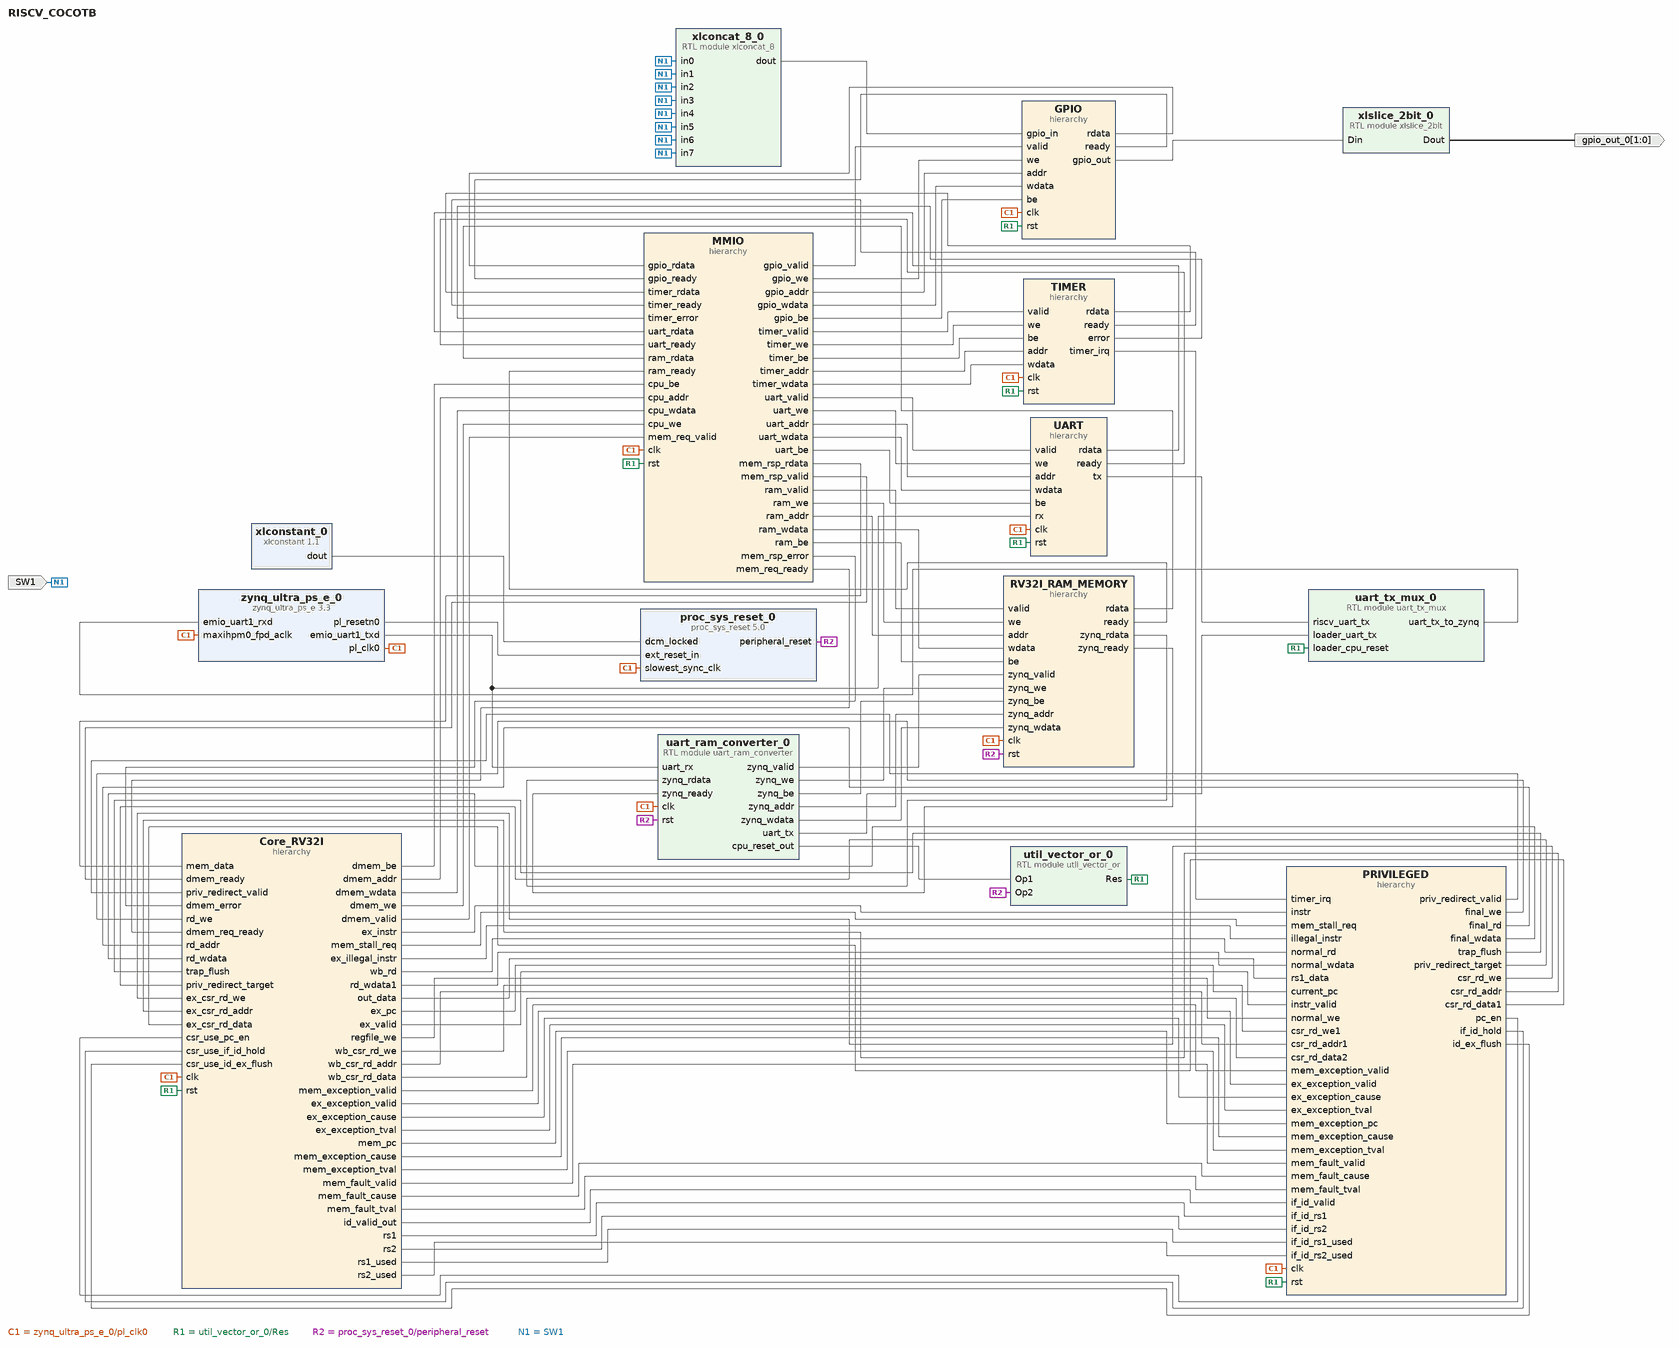
[diagram p0: block diagram of the top level]
# Vivado block design RISCV_COCOTB, xczu5ev-sfvc784-2-i, Vivado 2020.1
create_bd_design RISCV_COCOTB

create_bd_port -dir O -from 1 -to 0 gpio_out_0
create_bd_port -dir I SW1

create_bd_cell -type hier UART
create_bd_cell -type hier TIMER
create_bd_cell -type hier Core_RV32I
create_bd_cell -type hier MMIO
create_bd_cell -type hier PRIVILEGED
create_bd_cell -type hier GPIO
create_bd_cell -type hier RV32I_RAM_MEMORY
create_bd_cell -type module -reference xlconcat_8 xlconcat_8_0
create_bd_cell -type module -reference xlslice_2bit xlslice_2bit_0
create_bd_cell -type ip -vlnv xilinx.com:ip:zynq_ultra_ps_e:3.3 zynq_ultra_ps_e_0
set_property -dict [list \
  CONFIG.CAN0_BOARD_INTERFACE custom \
  CONFIG.CAN1_BOARD_INTERFACE custom \
  CONFIG.CSU_BOARD_INTERFACE custom \
  CONFIG.DP_BOARD_INTERFACE custom \
  CONFIG.GEM0_BOARD_INTERFACE custom \
  CONFIG.GEM1_BOARD_INTERFACE custom \
  CONFIG.GEM2_BOARD_INTERFACE custom \
  CONFIG.GEM3_BOARD_INTERFACE custom \
  CONFIG.GPIO_BOARD_INTERFACE custom \
  CONFIG.IIC0_BOARD_INTERFACE custom \
  CONFIG.IIC1_BOARD_INTERFACE custom \
  CONFIG.NAND_BOARD_INTERFACE custom \
  CONFIG.PCIE_BOARD_INTERFACE custom \
  CONFIG.PJTAG_BOARD_INTERFACE custom \
  CONFIG.PMU_BOARD_INTERFACE custom \
  CONFIG.PSU_BANK_0_IO_STANDARD LVCMOS18 \
  CONFIG.PSU_BANK_1_IO_STANDARD LVCMOS18 \
  CONFIG.PSU_BANK_2_IO_STANDARD LVCMOS18 \
  CONFIG.PSU_BANK_3_IO_STANDARD LVCMOS18 \
  CONFIG.PSU_USB3__DUAL_CLOCK_ENABLE 1 \
  CONFIG.PSU__CAN0__PERIPHERAL__ENABLE 1 \
  CONFIG.PSU__CAN0__PERIPHERAL__IO EMIO \
  CONFIG.PSU__CAN1__PERIPHERAL__ENABLE 0 \
  CONFIG.PSU__CRF_APB__ACPU_CTRL__FREQMHZ 1200 \
  CONFIG.PSU__CRF_APB__ACPU_CTRL__SRCSEL APLL \
  CONFIG.PSU__CRF_APB__APLL_CTRL__SRCSEL PSS_REF_CLK \
  CONFIG.PSU__CRF_APB__DBG_FPD_CTRL__FREQMHZ 250 \
  CONFIG.PSU__CRF_APB__DBG_FPD_CTRL__SRCSEL IOPLL \
  CONFIG.PSU__CRF_APB__DBG_TRACE_CTRL__FREQMHZ 250 \
  CONFIG.PSU__CRF_APB__DBG_TRACE_CTRL__SRCSEL IOPLL \
  CONFIG.PSU__CRF_APB__DBG_TSTMP_CTRL__FREQMHZ 250 \
  CONFIG.PSU__CRF_APB__DBG_TSTMP_CTRL__SRCSEL IOPLL \
  CONFIG.PSU__CRF_APB__DDR_CTRL__FREQMHZ 1200 \
  CONFIG.PSU__CRF_APB__DDR_CTRL__SRCSEL DPLL \
  CONFIG.PSU__CRF_APB__DPDMA_REF_CTRL__FREQMHZ 600 \
  CONFIG.PSU__CRF_APB__DPDMA_REF_CTRL__SRCSEL DPLL \
  CONFIG.PSU__CRF_APB__DPLL_CTRL__SRCSEL PSS_REF_CLK \
  CONFIG.PSU__CRF_APB__DP_AUDIO_REF_CTRL__SRCSEL RPLL \
  CONFIG.PSU__CRF_APB__DP_STC_REF_CTRL__SRCSEL RPLL \
  CONFIG.PSU__CRF_APB__DP_VIDEO_REF_CTRL__SRCSEL VPLL \
  CONFIG.PSU__CRF_APB__GDMA_REF_CTRL__FREQMHZ 600 \
  CONFIG.PSU__CRF_APB__GDMA_REF_CTRL__SRCSEL DPLL \
  CONFIG.PSU__CRF_APB__GPU_REF_CTRL__FREQMHZ 600 \
  CONFIG.PSU__CRF_APB__GPU_REF_CTRL__SRCSEL DPLL \
  CONFIG.PSU__CRF_APB__TOPSW_LSBUS_CTRL__FREQMHZ 100 \
  CONFIG.PSU__CRF_APB__TOPSW_LSBUS_CTRL__SRCSEL IOPLL \
  CONFIG.PSU__CRF_APB__TOPSW_MAIN_CTRL__FREQMHZ 533.333 \
  CONFIG.PSU__CRF_APB__TOPSW_MAIN_CTRL__SRCSEL DPLL \
  CONFIG.PSU__CRF_APB__VPLL_CTRL__SRCSEL PSS_REF_CLK \
  CONFIG.PSU__CRL_APB__ADMA_REF_CTRL__FREQMHZ 500 \
  CONFIG.PSU__CRL_APB__ADMA_REF_CTRL__SRCSEL IOPLL \
  CONFIG.PSU__CRL_APB__CAN1_REF_CTRL__FREQMHZ 100 \
  CONFIG.PSU__CRL_APB__CAN1_REF_CTRL__SRCSEL IOPLL \
  CONFIG.PSU__CRL_APB__CPU_R5_CTRL__FREQMHZ 500 \
  CONFIG.PSU__CRL_APB__CPU_R5_CTRL__SRCSEL IOPLL \
  CONFIG.PSU__CRL_APB__DBG_LPD_CTRL__FREQMHZ 250 \
  CONFIG.PSU__CRL_APB__DBG_LPD_CTRL__SRCSEL IOPLL \
  CONFIG.PSU__CRL_APB__GEM3_REF_CTRL__FREQMHZ 125 \
  CONFIG.PSU__CRL_APB__GEM3_REF_CTRL__SRCSEL IOPLL \
  CONFIG.PSU__CRL_APB__I2C0_REF_CTRL__FREQMHZ 100 \
  CONFIG.PSU__CRL_APB__I2C0_REF_CTRL__SRCSEL IOPLL \
  CONFIG.PSU__CRL_APB__I2C1_REF_CTRL__FREQMHZ 100 \
  CONFIG.PSU__CRL_APB__I2C1_REF_CTRL__SRCSEL IOPLL \
  CONFIG.PSU__CRL_APB__IOPLL_CTRL__SRCSEL PSS_REF_CLK \
  CONFIG.PSU__CRL_APB__IOU_SWITCH_CTRL__FREQMHZ 267 \
  CONFIG.PSU__CRL_APB__IOU_SWITCH_CTRL__SRCSEL RPLL \
  CONFIG.PSU__CRL_APB__LPD_LSBUS_CTRL__FREQMHZ 100 \
  CONFIG.PSU__CRL_APB__LPD_LSBUS_CTRL__SRCSEL IOPLL \
  CONFIG.PSU__CRL_APB__LPD_SWITCH_CTRL__FREQMHZ 500 \
  CONFIG.PSU__CRL_APB__LPD_SWITCH_CTRL__SRCSEL IOPLL \
  CONFIG.PSU__CRL_APB__PCAP_CTRL__FREQMHZ 200 \
  CONFIG.PSU__CRL_APB__PCAP_CTRL__SRCSEL IOPLL \
  CONFIG.PSU__CRL_APB__PL0_REF_CTRL__FREQMHZ 195 \
  CONFIG.PSU__CRL_APB__PL0_REF_CTRL__SRCSEL RPLL \
  CONFIG.PSU__CRL_APB__PL1_REF_CTRL__FREQMHZ 195 \
  CONFIG.PSU__CRL_APB__QSPI_REF_CTRL__FREQMHZ 300 \
  CONFIG.PSU__CRL_APB__QSPI_REF_CTRL__SRCSEL IOPLL \
  CONFIG.PSU__CRL_APB__RPLL_CTRL__SRCSEL PSS_REF_CLK \
  CONFIG.PSU__CRL_APB__SDIO1_REF_CTRL__FREQMHZ 200 \
  CONFIG.PSU__CRL_APB__SDIO1_REF_CTRL__SRCSEL RPLL \
  CONFIG.PSU__CRL_APB__TIMESTAMP_REF_CTRL__FREQMHZ 100 \
  CONFIG.PSU__CRL_APB__TIMESTAMP_REF_CTRL__SRCSEL PSS_REF_CLK \
  CONFIG.PSU__CRL_APB__UART0_REF_CTRL__FREQMHZ 100 \
  CONFIG.PSU__CRL_APB__UART0_REF_CTRL__SRCSEL IOPLL \
  CONFIG.PSU__CRL_APB__UART1_REF_CTRL__FREQMHZ 100 \
  CONFIG.PSU__CRL_APB__UART1_REF_CTRL__SRCSEL IOPLL \
  CONFIG.PSU__CRL_APB__USB0_BUS_REF_CTRL__FREQMHZ 250 \
  CONFIG.PSU__CRL_APB__USB0_BUS_REF_CTRL__SRCSEL IOPLL \
  CONFIG.PSU__CRL_APB__USB3_DUAL_REF_CTRL__FREQMHZ 20 \
  CONFIG.PSU__CRL_APB__USB3_DUAL_REF_CTRL__SRCSEL IOPLL \
  CONFIG.PSU__CRL_APB__USB3__ENABLE 1 \
  CONFIG.PSU__CSUPMU__PERIPHERAL__VALID 0 \
  CONFIG.PSU__DDRC__BUS_WIDTH {64 Bit} \
  CONFIG.PSU__DDRC__COMPONENTS Components \
  CONFIG.PSU__DDRC__DEVICE_CAPACITY {8192 MBits} \
  CONFIG.PSU__DDRC__DRAM_WIDTH {16 Bits} \
  CONFIG.PSU__DDRC__ECC Disabled \
  CONFIG.PSU__DDRC__MEMORY_TYPE {DDR 4} \
  CONFIG.PSU__DDRC__SPEED_BIN DDR4_2400R \
  CONFIG.PSU__DDR_HIGH_ADDRESS_GUI_ENABLE 1 \
  CONFIG.PSU__DDR__INTERFACE__FREQMHZ 600.000 \
  CONFIG.PSU__DEVICE_TYPE EV \
  CONFIG.PSU__DISPLAYPORT__LANE0__ENABLE 1 \
  CONFIG.PSU__DISPLAYPORT__LANE0__IO {GT Lane3} \
  CONFIG.PSU__DISPLAYPORT__LANE1__ENABLE 0 \
  CONFIG.PSU__DISPLAYPORT__PERIPHERAL__ENABLE 1 \
  CONFIG.PSU__DLL__ISUSED 1 \
  CONFIG.PSU__DPAUX__PERIPHERAL__ENABLE 1 \
  CONFIG.PSU__DPAUX__PERIPHERAL__IO {MIO 27 .. 30} \
  CONFIG.PSU__DP__LANE_SEL {Single Higher} \
  CONFIG.PSU__DP__REF_CLK_FREQ 108 \
  CONFIG.PSU__DP__REF_CLK_SEL {Ref Clk3} \
  CONFIG.PSU__ENET3__FIFO__ENABLE 0 \
  CONFIG.PSU__ENET3__GRP_MDIO__ENABLE 1 \
  CONFIG.PSU__ENET3__GRP_MDIO__IO {MIO 76 .. 77} \
  CONFIG.PSU__ENET3__PERIPHERAL__ENABLE 1 \
  CONFIG.PSU__ENET3__PERIPHERAL__IO {MIO 64 .. 75} \
  CONFIG.PSU__ENET3__PTP__ENABLE 0 \
  CONFIG.PSU__ENET3__TSU__ENABLE 0 \
  CONFIG.PSU__FPGA_PL0_ENABLE 1 \
  CONFIG.PSU__FPGA_PL1_ENABLE 1 \
  CONFIG.PSU__GEM3_COHERENCY 0 \
  CONFIG.PSU__GEM3_ROUTE_THROUGH_FPD 0 \
  CONFIG.PSU__GEM__TSU__ENABLE 0 \
  CONFIG.PSU__GPIO0_MIO__IO {MIO 0 .. 25} \
  CONFIG.PSU__GPIO0_MIO__PERIPHERAL__ENABLE 1 \
  CONFIG.PSU__GPIO1_MIO__IO {MIO 26 .. 51} \
  CONFIG.PSU__GPIO1_MIO__PERIPHERAL__ENABLE 1 \
  CONFIG.PSU__GPIO_EMIO_WIDTH 95 \
  CONFIG.PSU__GPIO_EMIO__PERIPHERAL__ENABLE 1 \
  CONFIG.PSU__GPIO_EMIO__PERIPHERAL__IO 95 \
  CONFIG.PSU__GT__LINK_SPEED HBR \
  CONFIG.PSU__GT__PRE_EMPH_LVL_4 0 \
  CONFIG.PSU__GT__VLT_SWNG_LVL_4 0 \
  CONFIG.PSU__I2C0__PERIPHERAL__ENABLE 1 \
  CONFIG.PSU__I2C0__PERIPHERAL__IO EMIO \
  CONFIG.PSU__I2C1__PERIPHERAL__ENABLE 1 \
  CONFIG.PSU__I2C1__PERIPHERAL__IO {MIO 24 .. 25} \
  CONFIG.PSU__IOU_SLCR__IOU_TTC_APB_CLK__TTC0_SEL APB \
  CONFIG.PSU__IOU_SLCR__IOU_TTC_APB_CLK__TTC1_SEL APB \
  CONFIG.PSU__IOU_SLCR__IOU_TTC_APB_CLK__TTC2_SEL APB \
  CONFIG.PSU__IOU_SLCR__IOU_TTC_APB_CLK__TTC3_SEL APB \
  CONFIG.PSU__LPD_SLCR__CSUPMU__FREQMHZ 100 \
  CONFIG.PSU__MAXIGP0__DATA_WIDTH 32 \
  CONFIG.PSU__OVERRIDE_HPX_QOS 0 \
  CONFIG.PSU__OVERRIDE__BASIC_CLOCK 0 \
  CONFIG.PSU__PMU__PERIPHERAL__ENABLE 0 \
  CONFIG.PSU__PRESET_APPLIED 0 \
  CONFIG.PSU__PSS_REF_CLK__FREQMHZ 33.333 \
  CONFIG.PSU__QSPI_COHERENCY 0 \
  CONFIG.PSU__QSPI_ROUTE_THROUGH_FPD 0 \
  CONFIG.PSU__QSPI__GRP_FBCLK__ENABLE 0 \
  CONFIG.PSU__QSPI__PERIPHERAL__DATA_MODE x4 \
  CONFIG.PSU__QSPI__PERIPHERAL__ENABLE 1 \
  CONFIG.PSU__QSPI__PERIPHERAL__IO {MIO 0 .. 12} \
  CONFIG.PSU__QSPI__PERIPHERAL__MODE {Dual Parallel} \
  CONFIG.PSU__SATA__LANE1__IO {GT Lane1} \
  CONFIG.PSU__SATA__PERIPHERAL__ENABLE 1 \
  CONFIG.PSU__SATA__REF_CLK_FREQ 125 \
  CONFIG.PSU__SATA__REF_CLK_SEL {Ref Clk1} \
  CONFIG.PSU__SD0__DATA_TRANSFER_MODE 8Bit \
  CONFIG.PSU__SD0__GRP_POW__ENABLE 1 \
  CONFIG.PSU__SD0__GRP_POW__IO {MIO 23} \
  CONFIG.PSU__SD0__PERIPHERAL__ENABLE 1 \
  CONFIG.PSU__SD0__PERIPHERAL__IO {MIO 13 .. 22} \
  CONFIG.PSU__SD0__RESET__ENABLE 1 \
  CONFIG.PSU__SD0__SLOT_TYPE eMMC \
  CONFIG.PSU__SD1_COHERENCY 0 \
  CONFIG.PSU__SD1_ROUTE_THROUGH_FPD 0 \
  CONFIG.PSU__SD1__DATA_TRANSFER_MODE 4Bit \
  CONFIG.PSU__SD1__GRP_CD__ENABLE 1 \
  CONFIG.PSU__SD1__GRP_CD__IO {MIO 45} \
  CONFIG.PSU__SD1__GRP_POW__ENABLE 0 \
  CONFIG.PSU__SD1__GRP_WP__ENABLE 1 \
  CONFIG.PSU__SD1__GRP_WP__IO {MIO 44} \
  CONFIG.PSU__SD1__PERIPHERAL__ENABLE 1 \
  CONFIG.PSU__SD1__PERIPHERAL__IO {MIO 46 .. 51} \
  CONFIG.PSU__SD1__SLOT_TYPE {SD 2.0} \
  CONFIG.PSU__SWDT0__CLOCK__ENABLE 0 \
  CONFIG.PSU__SWDT0__PERIPHERAL__ENABLE 1 \
  CONFIG.PSU__SWDT0__RESET__ENABLE 0 \
  CONFIG.PSU__SWDT1__CLOCK__ENABLE 0 \
  CONFIG.PSU__SWDT1__PERIPHERAL__ENABLE 1 \
  CONFIG.PSU__SWDT1__RESET__ENABLE 0 \
  CONFIG.PSU__TSU__BUFG_PORT_PAIR 0 \
  CONFIG.PSU__TTC0__CLOCK__ENABLE 0 \
  CONFIG.PSU__TTC0__PERIPHERAL__ENABLE 1 \
  CONFIG.PSU__TTC0__WAVEOUT__ENABLE 0 \
  CONFIG.PSU__TTC1__CLOCK__ENABLE 0 \
  CONFIG.PSU__TTC1__PERIPHERAL__ENABLE 1 \
  CONFIG.PSU__TTC1__WAVEOUT__ENABLE 0 \
  CONFIG.PSU__TTC2__CLOCK__ENABLE 0 \
  CONFIG.PSU__TTC2__PERIPHERAL__ENABLE 1 \
  CONFIG.PSU__TTC2__WAVEOUT__ENABLE 0 \
  CONFIG.PSU__TTC3__CLOCK__ENABLE 0 \
  CONFIG.PSU__TTC3__PERIPHERAL__ENABLE 1 \
  CONFIG.PSU__TTC3__WAVEOUT__ENABLE 0 \
  CONFIG.PSU__UART0__BAUD_RATE 115200 \
  CONFIG.PSU__UART0__MODEM__ENABLE 0 \
  CONFIG.PSU__UART0__PERIPHERAL__ENABLE 1 \
  CONFIG.PSU__UART0__PERIPHERAL__IO {MIO 34 .. 35} \
  CONFIG.PSU__UART1__BAUD_RATE 921600 \
  CONFIG.PSU__UART1__MODEM__ENABLE 0 \
  CONFIG.PSU__UART1__PERIPHERAL__ENABLE 1 \
  CONFIG.PSU__UART1__PERIPHERAL__IO EMIO \
  CONFIG.PSU__USB0_COHERENCY 0 \
  CONFIG.PSU__USB0__PERIPHERAL__ENABLE 1 \
  CONFIG.PSU__USB0__PERIPHERAL__IO {MIO 52 .. 63} \
  CONFIG.PSU__USB0__REF_CLK_FREQ 52 \
  CONFIG.PSU__USB0__REF_CLK_SEL {Ref Clk2} \
  CONFIG.PSU__USB2_0__EMIO__ENABLE 0 \
  CONFIG.PSU__USB3_0__EMIO__ENABLE 0 \
  CONFIG.PSU__USB3_0__PERIPHERAL__ENABLE 1 \
  CONFIG.PSU__USB3_0__PERIPHERAL__IO {GT Lane2} \
  CONFIG.PSU__USB__RESET__MODE {Boot Pin} \
  CONFIG.PSU__USB__RESET__POLARITY {Active Low} \
  CONFIG.PSU__USE__IRQ0 0 \
  CONFIG.PSU__USE__M_AXI_GP0 1 \
  CONFIG.PSU__USE__M_AXI_GP1 0 \
  CONFIG.PSU__USE__M_AXI_GP2 0 \
  CONFIG.QSPI_BOARD_INTERFACE custom \
  CONFIG.SATA_BOARD_INTERFACE custom \
  CONFIG.SD0_BOARD_INTERFACE custom \
  CONFIG.SD1_BOARD_INTERFACE custom \
  CONFIG.SPI0_BOARD_INTERFACE custom \
  CONFIG.SPI1_BOARD_INTERFACE custom \
  CONFIG.SUBPRESET1 Custom \
  CONFIG.SUBPRESET2 Custom \
  CONFIG.SWDT0_BOARD_INTERFACE custom \
  CONFIG.SWDT1_BOARD_INTERFACE custom \
  CONFIG.TRACE_BOARD_INTERFACE custom \
  CONFIG.TTC0_BOARD_INTERFACE custom \
  CONFIG.TTC1_BOARD_INTERFACE custom \
  CONFIG.TTC2_BOARD_INTERFACE custom \
  CONFIG.TTC3_BOARD_INTERFACE custom \
  CONFIG.UART0_BOARD_INTERFACE custom \
  CONFIG.UART1_BOARD_INTERFACE custom \
  CONFIG.USB0_BOARD_INTERFACE custom \
  CONFIG.USB1_BOARD_INTERFACE custom \
] [get_bd_cells zynq_ultra_ps_e_0]
# 741 more settings of zynq_ultra_ps_e_0 are not shown: defaults, MIO pin electricals, DDR timing, and values the tool derives
create_bd_cell -type ip -vlnv xilinx.com:ip:xlconstant:1.1 xlconstant_0
set_property -dict {CONFIG.CONST_VAL 1} [get_bd_cells xlconstant_0]
create_bd_cell -type ip -vlnv xilinx.com:ip:proc_sys_reset:5.0 proc_sys_reset_0
create_bd_cell -type module -reference uart_ram_converter uart_ram_converter_0
create_bd_cell -type module -reference util_vector_or util_vector_or_0
create_bd_cell -type module -reference uart_tx_mux uart_tx_mux_0

# ---- hierarchy /UART ----
current_bd_instance /UART
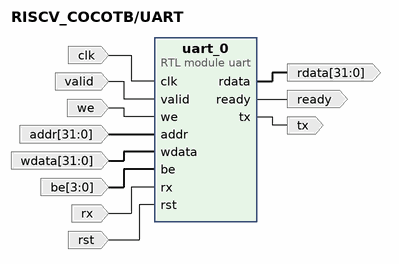
[diagram p1: block diagram inside /UART]
create_bd_pin -dir I -type clk clk
create_bd_pin -dir I -type rst rst
create_bd_pin -dir I valid
create_bd_pin -dir I we
create_bd_pin -dir I -from 31 -to 0 addr
create_bd_pin -dir I -from 31 -to 0 wdata
create_bd_pin -dir I -from 3 -to 0 be
create_bd_pin -dir O -from 31 -to 0 rdata
create_bd_pin -dir O ready
create_bd_pin -dir O tx
create_bd_pin -dir I rx

create_bd_cell -type module -reference uart uart_0
set_property -dict {CONFIG.BAUD 921000 CONFIG.CLK_FREQ 190474289 CONFIG.FIFO_DEPTH 64} [get_bd_cells uart_0]

# ---- hierarchy /TIMER ----
current_bd_instance /TIMER
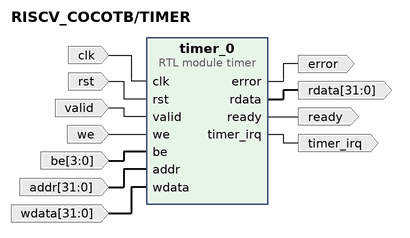
[diagram p2: block diagram inside /TIMER]
create_bd_pin -dir I -type clk clk
create_bd_pin -dir I -type rst rst
create_bd_pin -dir I valid
create_bd_pin -dir I we
create_bd_pin -dir I -from 3 -to 0 be
create_bd_pin -dir I -from 31 -to 0 addr
create_bd_pin -dir I -from 31 -to 0 wdata
create_bd_pin -dir O -from 31 -to 0 rdata
create_bd_pin -dir O ready
create_bd_pin -dir O -type intr timer_irq
create_bd_pin -dir O error

create_bd_cell -type module -reference timer timer_0
set_property -dict {CONFIG.RESET_CMP 0x0002E7CA} [get_bd_cells timer_0]

# ---- hierarchy /Core_RV32I ----
current_bd_instance /Core_RV32I
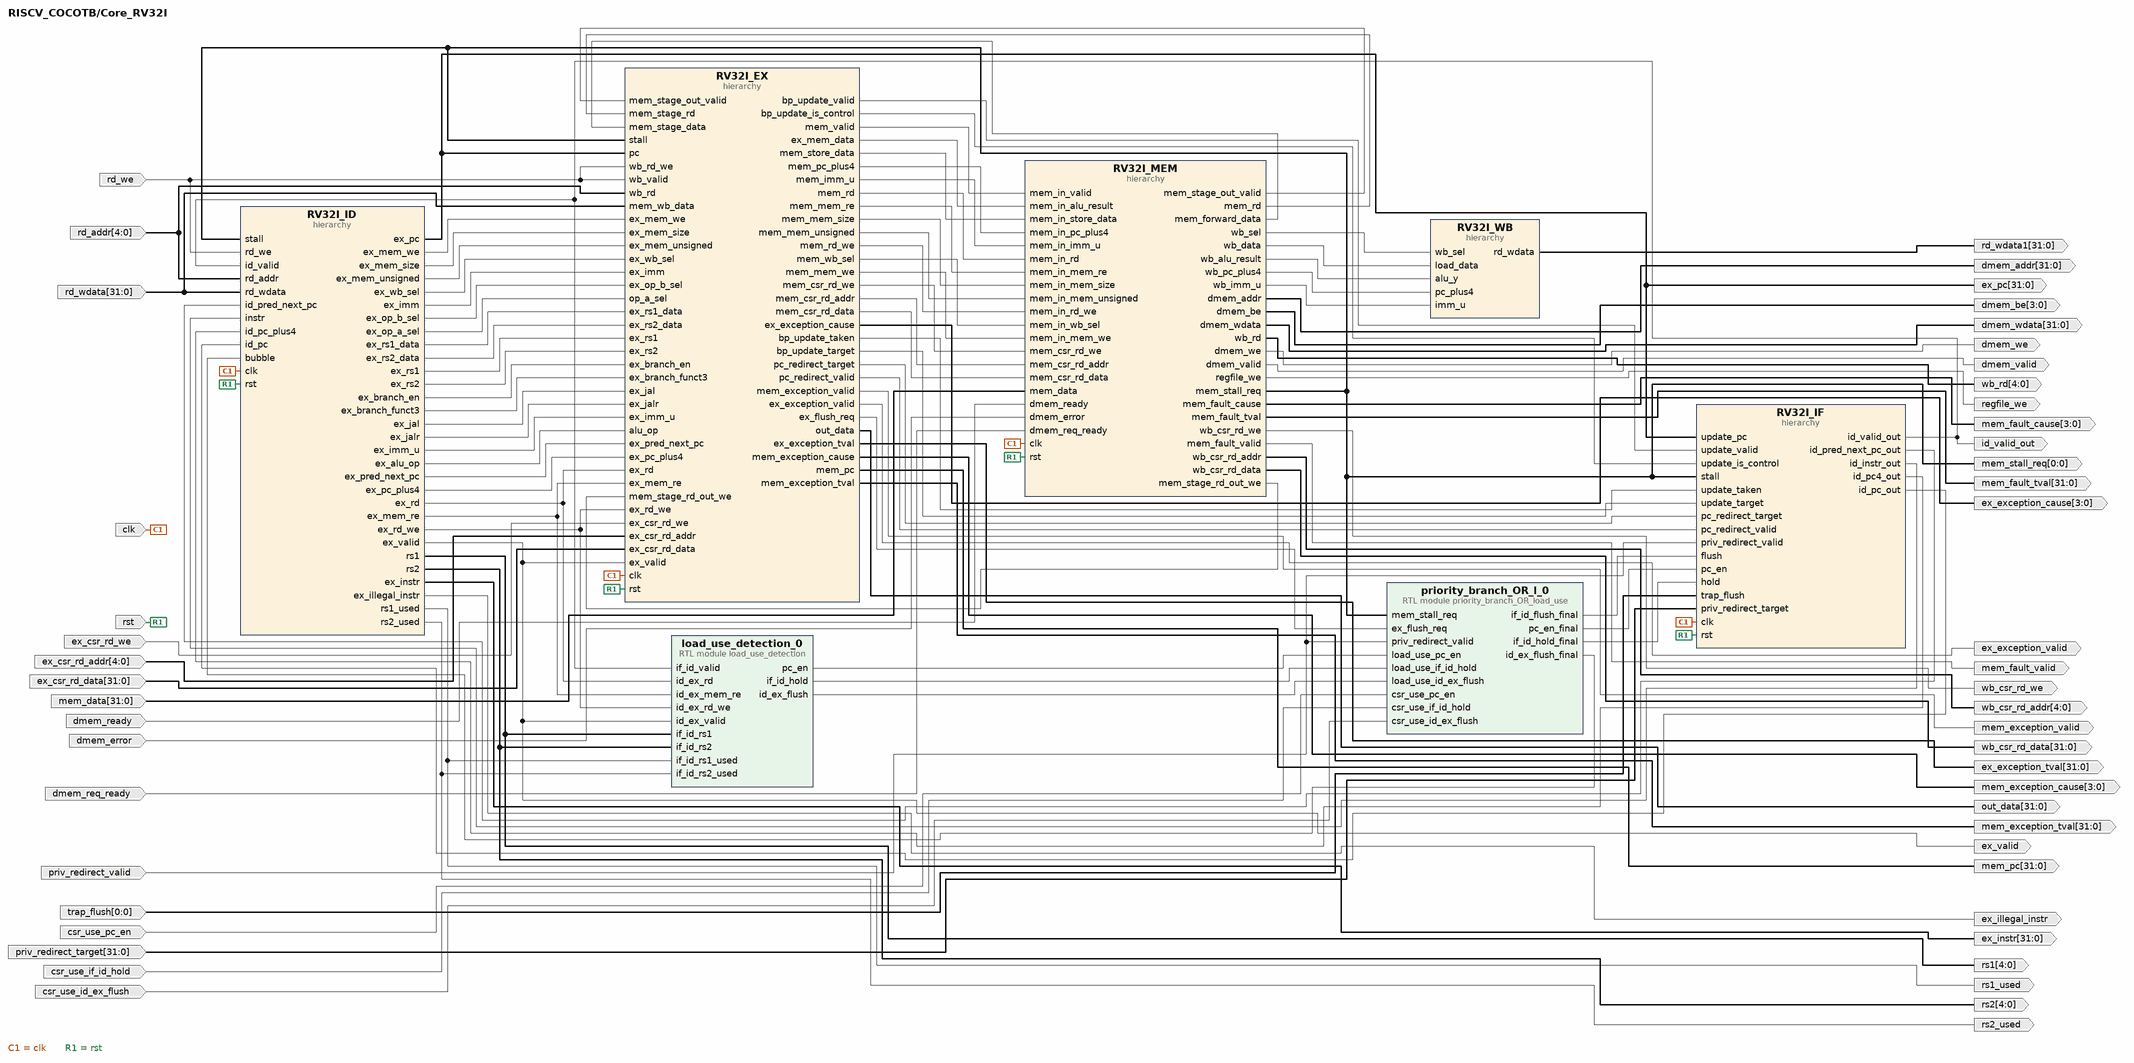
[diagram p3: block diagram inside /Core_RV32I]
create_bd_pin -dir I -type clk clk
create_bd_pin -dir I -type rst rst
create_bd_pin -dir I -from 31 -to 0 mem_data
create_bd_pin -dir O -from 3 -to 0 dmem_be
create_bd_pin -dir O -from 31 -to 0 dmem_addr
create_bd_pin -dir O -from 31 -to 0 dmem_wdata
create_bd_pin -dir O dmem_we
create_bd_pin -dir I dmem_ready
create_bd_pin -dir O -from 31 -to 0 ex_instr
create_bd_pin -dir O -from 0 -to 0 mem_stall_req
create_bd_pin -dir O ex_illegal_instr
create_bd_pin -dir I priv_redirect_valid
create_bd_pin -dir I rd_we
create_bd_pin -dir I -from 4 -to 0 rd_addr
create_bd_pin -dir I -from 31 -to 0 rd_wdata
create_bd_pin -dir O -from 4 -to 0 wb_rd
create_bd_pin -dir O -from 31 -to 0 rd_wdata1
create_bd_pin -dir O -from 31 -to 0 out_data
create_bd_pin -dir O -from 31 -to 0 ex_pc
create_bd_pin -dir O ex_valid
create_bd_pin -dir I -from 0 -to 0 trap_flush
create_bd_pin -dir I -from 31 -to 0 priv_redirect_target
create_bd_pin -dir I dmem_error
create_bd_pin -dir O regfile_we
create_bd_pin -dir O dmem_valid
create_bd_pin -dir I dmem_req_ready
create_bd_pin -dir I ex_csr_rd_we
create_bd_pin -dir I -from 4 -to 0 ex_csr_rd_addr
create_bd_pin -dir I -from 31 -to 0 ex_csr_rd_data
create_bd_pin -dir O wb_csr_rd_we
create_bd_pin -dir O -from 4 -to 0 wb_csr_rd_addr
create_bd_pin -dir O -from 31 -to 0 wb_csr_rd_data
create_bd_pin -dir O mem_exception_valid
create_bd_pin -dir O ex_exception_valid
create_bd_pin -dir O -from 3 -to 0 ex_exception_cause
create_bd_pin -dir O -from 31 -to 0 ex_exception_tval
create_bd_pin -dir O -from 31 -to 0 mem_pc
create_bd_pin -dir O -from 3 -to 0 mem_exception_cause
create_bd_pin -dir O -from 31 -to 0 mem_exception_tval
create_bd_pin -dir O mem_fault_valid
create_bd_pin -dir O -from 3 -to 0 mem_fault_cause
create_bd_pin -dir O -from 31 -to 0 mem_fault_tval
create_bd_pin -dir O id_valid_out
create_bd_pin -dir O -from 4 -to 0 rs1
create_bd_pin -dir O -from 4 -to 0 rs2
create_bd_pin -dir O rs1_used
create_bd_pin -dir O rs2_used
create_bd_pin -dir I csr_use_pc_en
create_bd_pin -dir I csr_use_if_id_hold
create_bd_pin -dir I csr_use_id_ex_flush

create_bd_cell -type hier RV32I_MEM
create_bd_cell -type hier RV32I_EX
create_bd_cell -type hier RV32I_WB
create_bd_cell -type hier RV32I_ID
create_bd_cell -type hier RV32I_IF
create_bd_cell -type module -reference load_use_detection load_use_detection_0
create_bd_cell -type module -reference priority_branch_OR_load_use priority_branch_OR_l_0

# ---- hierarchy /Core_RV32I/RV32I_MEM ----
current_bd_instance /Core_RV32I/RV32I_MEM
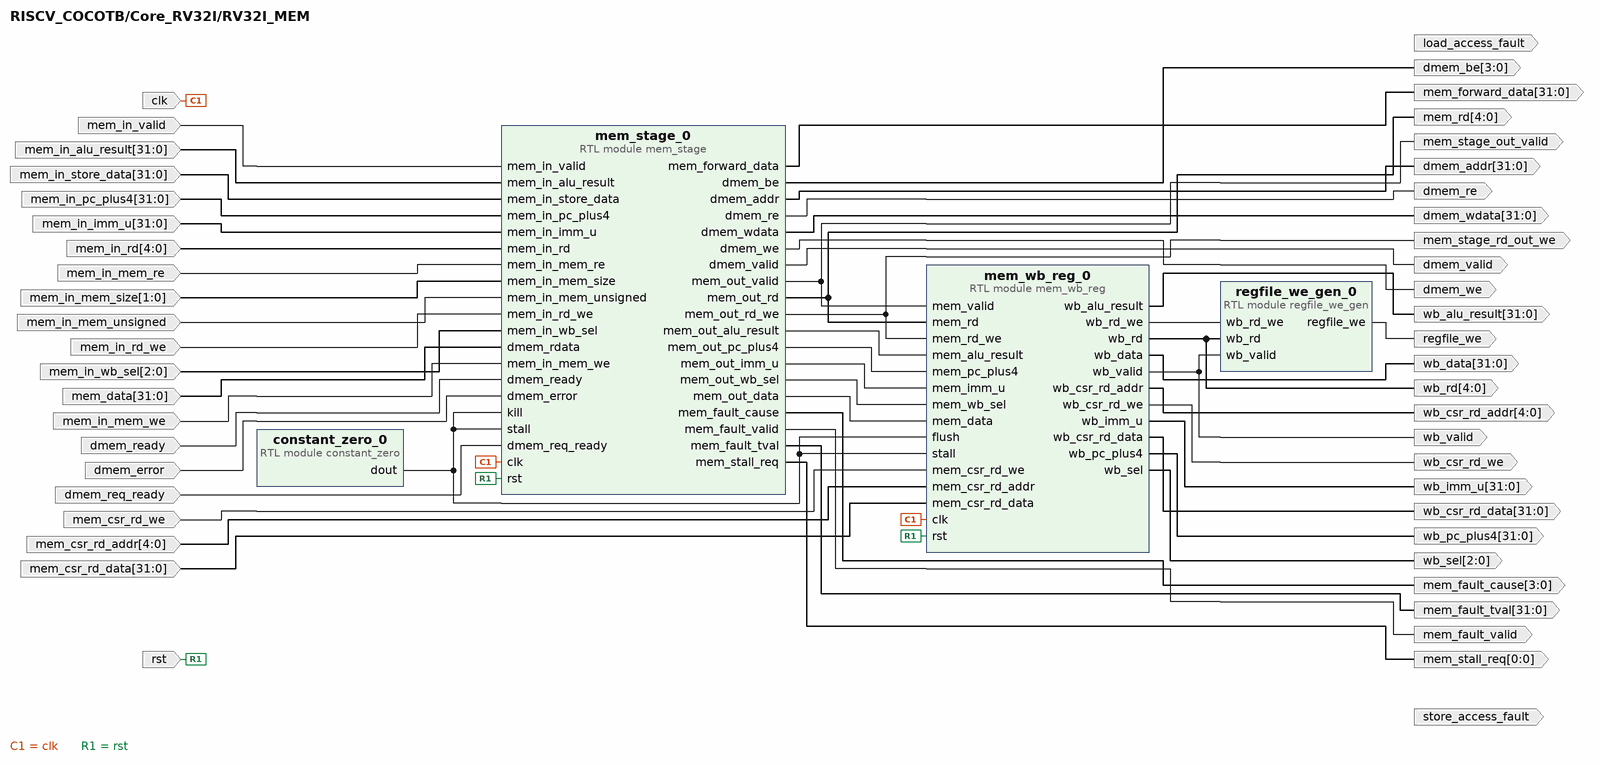
[diagram p4: block diagram inside /Core_RV32I/RV32I_MEM]
create_bd_pin -dir I -type clk clk
create_bd_pin -dir I -type rst rst
create_bd_pin -dir I mem_in_valid
create_bd_pin -dir I -from 31 -to 0 mem_in_alu_result
create_bd_pin -dir I -from 31 -to 0 mem_in_store_data
create_bd_pin -dir I -from 31 -to 0 mem_in_pc_plus4
create_bd_pin -dir I -from 31 -to 0 mem_in_imm_u
create_bd_pin -dir I -from 4 -to 0 mem_in_rd
create_bd_pin -dir I mem_in_mem_re
create_bd_pin -dir I mem_in_mem_we
create_bd_pin -dir I -from 1 -to 0 mem_in_mem_size
create_bd_pin -dir I mem_in_mem_unsigned
create_bd_pin -dir I mem_in_rd_we
create_bd_pin -dir I -from 2 -to 0 mem_in_wb_sel
create_bd_pin -dir O mem_stage_out_valid
create_bd_pin -dir O -from 4 -to 0 mem_rd
create_bd_pin -dir O mem_stage_rd_out_we
create_bd_pin -dir O -from 31 -to 0 mem_forward_data
create_bd_pin -dir O -from 31 -to 0 wb_data
create_bd_pin -dir O -from 31 -to 0 wb_alu_result
create_bd_pin -dir O -from 31 -to 0 wb_pc_plus4
create_bd_pin -dir O -from 31 -to 0 wb_imm_u
create_bd_pin -dir O -from 4 -to 0 wb_rd
create_bd_pin -dir O -from 2 -to 0 wb_sel
create_bd_pin -dir I -from 31 -to 0 mem_data
create_bd_pin -dir O -from 3 -to 0 dmem_be
create_bd_pin -dir O -from 31 -to 0 dmem_addr
create_bd_pin -dir O -from 31 -to 0 dmem_wdata
create_bd_pin -dir O dmem_we
create_bd_pin -dir O wb_valid
create_bd_pin -dir O dmem_re
create_bd_pin -dir I dmem_ready
create_bd_pin -dir O -from 0 -to 0 mem_stall_req
create_bd_pin -dir I dmem_error
create_bd_pin -dir O load_access_fault
create_bd_pin -dir O store_access_fault
create_bd_pin -dir O regfile_we
create_bd_pin -dir O dmem_valid
create_bd_pin -dir I dmem_req_ready
create_bd_pin -dir I mem_csr_rd_we
create_bd_pin -dir I -from 4 -to 0 mem_csr_rd_addr
create_bd_pin -dir I -from 31 -to 0 mem_csr_rd_data
create_bd_pin -dir O wb_csr_rd_we
create_bd_pin -dir O -from 4 -to 0 wb_csr_rd_addr
create_bd_pin -dir O -from 31 -to 0 wb_csr_rd_data
create_bd_pin -dir O mem_fault_valid
create_bd_pin -dir O -from 3 -to 0 mem_fault_cause
create_bd_pin -dir O -from 31 -to 0 mem_fault_tval

create_bd_cell -type module -reference regfile_we_gen regfile_we_gen_0
create_bd_cell -type module -reference mem_wb_reg mem_wb_reg_0
create_bd_cell -type module -reference constant_zero constant_zero_0
create_bd_cell -type module -reference mem_stage mem_stage_0

# ---- hierarchy /Core_RV32I/RV32I_EX ----
current_bd_instance /Core_RV32I/RV32I_EX
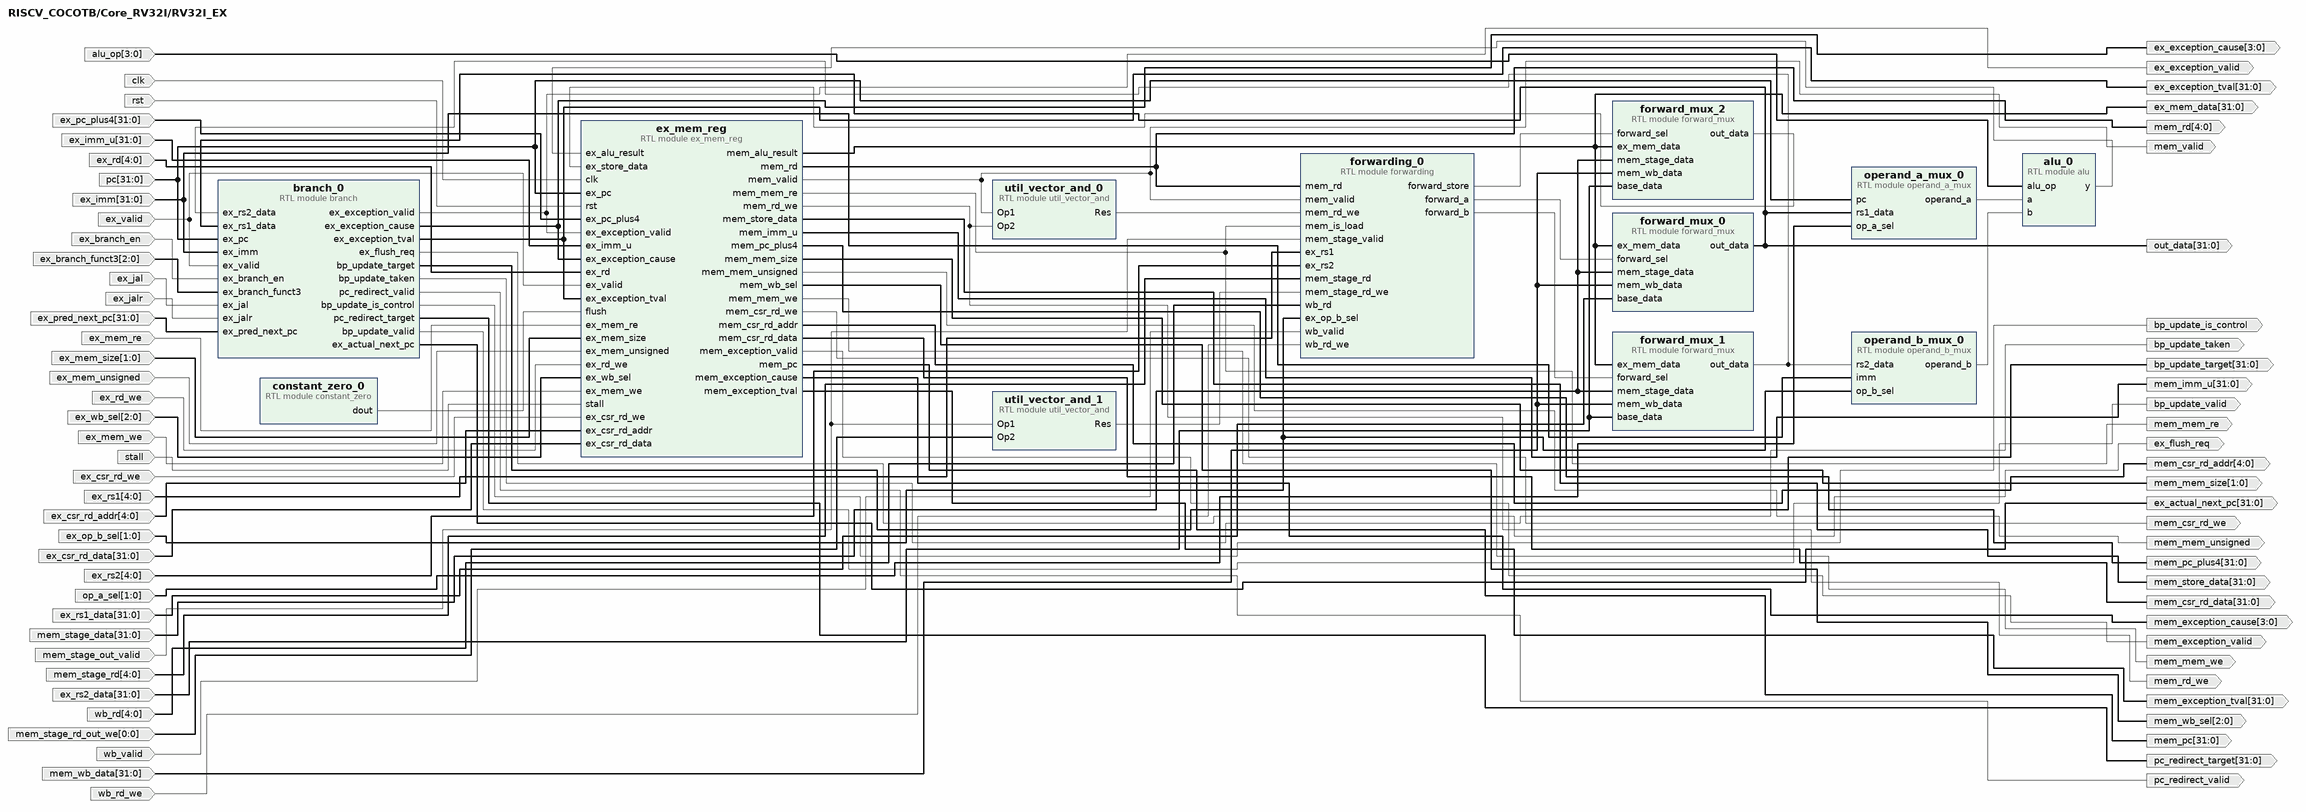
[diagram p5: block diagram inside /Core_RV32I/RV32I_EX]
create_bd_pin -dir I -from 3 -to 0 alu_op
create_bd_pin -dir I -type clk clk
create_bd_pin -dir I -type rst rst
create_bd_pin -dir I ex_valid
create_bd_pin -dir I -from 31 -to 0 pc
create_bd_pin -dir I -from 31 -to 0 ex_pc_plus4
create_bd_pin -dir I -from 31 -to 0 ex_imm_u
create_bd_pin -dir I -from 4 -to 0 ex_rd
create_bd_pin -dir I ex_mem_re
create_bd_pin -dir I ex_mem_we
create_bd_pin -dir I -from 1 -to 0 ex_mem_size
create_bd_pin -dir I ex_mem_unsigned
create_bd_pin -dir I ex_rd_we
create_bd_pin -dir I -from 2 -to 0 ex_wb_sel
create_bd_pin -dir O mem_valid
create_bd_pin -dir O -from 31 -to 0 ex_mem_data
create_bd_pin -dir O -from 31 -to 0 mem_store_data
create_bd_pin -dir O -from 31 -to 0 mem_pc_plus4
create_bd_pin -dir O -from 31 -to 0 mem_imm_u
create_bd_pin -dir O -from 4 -to 0 mem_rd
create_bd_pin -dir O mem_mem_re
create_bd_pin -dir O mem_mem_we
create_bd_pin -dir O -from 1 -to 0 mem_mem_size
create_bd_pin -dir O mem_mem_unsigned
create_bd_pin -dir O mem_rd_we
create_bd_pin -dir O -from 2 -to 0 mem_wb_sel
create_bd_pin -dir I -from 31 -to 0 ex_imm
create_bd_pin -dir I -from 1 -to 0 ex_op_b_sel
create_bd_pin -dir I -from 1 -to 0 op_a_sel
create_bd_pin -dir I -from 31 -to 0 ex_rs1_data
create_bd_pin -dir I -from 31 -to 0 mem_stage_data
create_bd_pin -dir I -from 31 -to 0 mem_wb_data
create_bd_pin -dir I -from 31 -to 0 ex_rs2_data
create_bd_pin -dir I -from 4 -to 0 ex_rs1
create_bd_pin -dir I -from 4 -to 0 ex_rs2
create_bd_pin -dir I -from 4 -to 0 mem_stage_rd
create_bd_pin -dir I -from 4 -to 0 wb_rd
create_bd_pin -dir I ex_branch_en
create_bd_pin -dir I -from 2 -to 0 ex_branch_funct3
create_bd_pin -dir I ex_jal
create_bd_pin -dir I ex_jalr
create_bd_pin -dir O pc_redirect_valid
create_bd_pin -dir O -from 31 -to 0 pc_redirect_target
create_bd_pin -dir O ex_flush_req
create_bd_pin -dir I mem_stage_out_valid
create_bd_pin -dir I wb_valid
create_bd_pin -dir I -from 31 -to 0 ex_pred_next_pc
create_bd_pin -dir O -from 31 -to 0 bp_update_target
create_bd_pin -dir O bp_update_taken
create_bd_pin -dir O bp_update_is_control
create_bd_pin -dir O bp_update_valid
create_bd_pin -dir O -from 31 -to 0 ex_actual_next_pc
create_bd_pin -dir I stall
create_bd_pin -dir O -from 31 -to 0 out_data
create_bd_pin -dir I -from 0 -to 0 mem_stage_rd_out_we
create_bd_pin -dir I wb_rd_we
create_bd_pin -dir I ex_csr_rd_we
create_bd_pin -dir I -from 4 -to 0 ex_csr_rd_addr
create_bd_pin -dir I -from 31 -to 0 ex_csr_rd_data
create_bd_pin -dir O mem_csr_rd_we
create_bd_pin -dir O -from 4 -to 0 mem_csr_rd_addr
create_bd_pin -dir O -from 31 -to 0 mem_csr_rd_data
create_bd_pin -dir O mem_exception_valid
create_bd_pin -dir O ex_exception_valid
create_bd_pin -dir O -from 3 -to 0 ex_exception_cause
create_bd_pin -dir O -from 31 -to 0 ex_exception_tval
create_bd_pin -dir O -from 31 -to 0 mem_pc
create_bd_pin -dir O -from 3 -to 0 mem_exception_cause
create_bd_pin -dir O -from 31 -to 0 mem_exception_tval

create_bd_cell -type module -reference alu alu_0
create_bd_cell -type module -reference operand_b_mux operand_b_mux_0
create_bd_cell -type module -reference operand_a_mux operand_a_mux_0
create_bd_cell -type module -reference branch branch_0
create_bd_cell -type module -reference ex_mem_reg ex_mem_reg
create_bd_cell -type module -reference util_vector_and util_vector_and_0
create_bd_cell -type module -reference util_vector_and util_vector_and_1
create_bd_cell -type module -reference forward_mux forward_mux_0
create_bd_cell -type module -reference forward_mux forward_mux_1
create_bd_cell -type module -reference forward_mux forward_mux_2
create_bd_cell -type module -reference forwarding forwarding_0
create_bd_cell -type module -reference constant_zero constant_zero_0

# ---- hierarchy /Core_RV32I/RV32I_WB ----
current_bd_instance /Core_RV32I/RV32I_WB
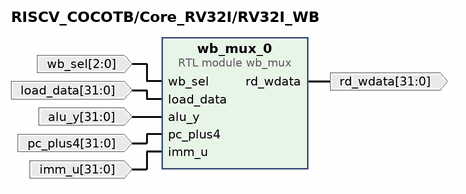
[diagram p6: block diagram inside /Core_RV32I/RV32I_WB]
create_bd_pin -dir O -from 31 -to 0 rd_wdata
create_bd_pin -dir I -from 2 -to 0 wb_sel
create_bd_pin -dir I -from 31 -to 0 load_data
create_bd_pin -dir I -from 31 -to 0 alu_y
create_bd_pin -dir I -from 31 -to 0 pc_plus4
create_bd_pin -dir I -from 31 -to 0 imm_u

create_bd_cell -type module -reference wb_mux wb_mux_0

# ---- hierarchy /Core_RV32I/RV32I_ID ----
current_bd_instance /Core_RV32I/RV32I_ID
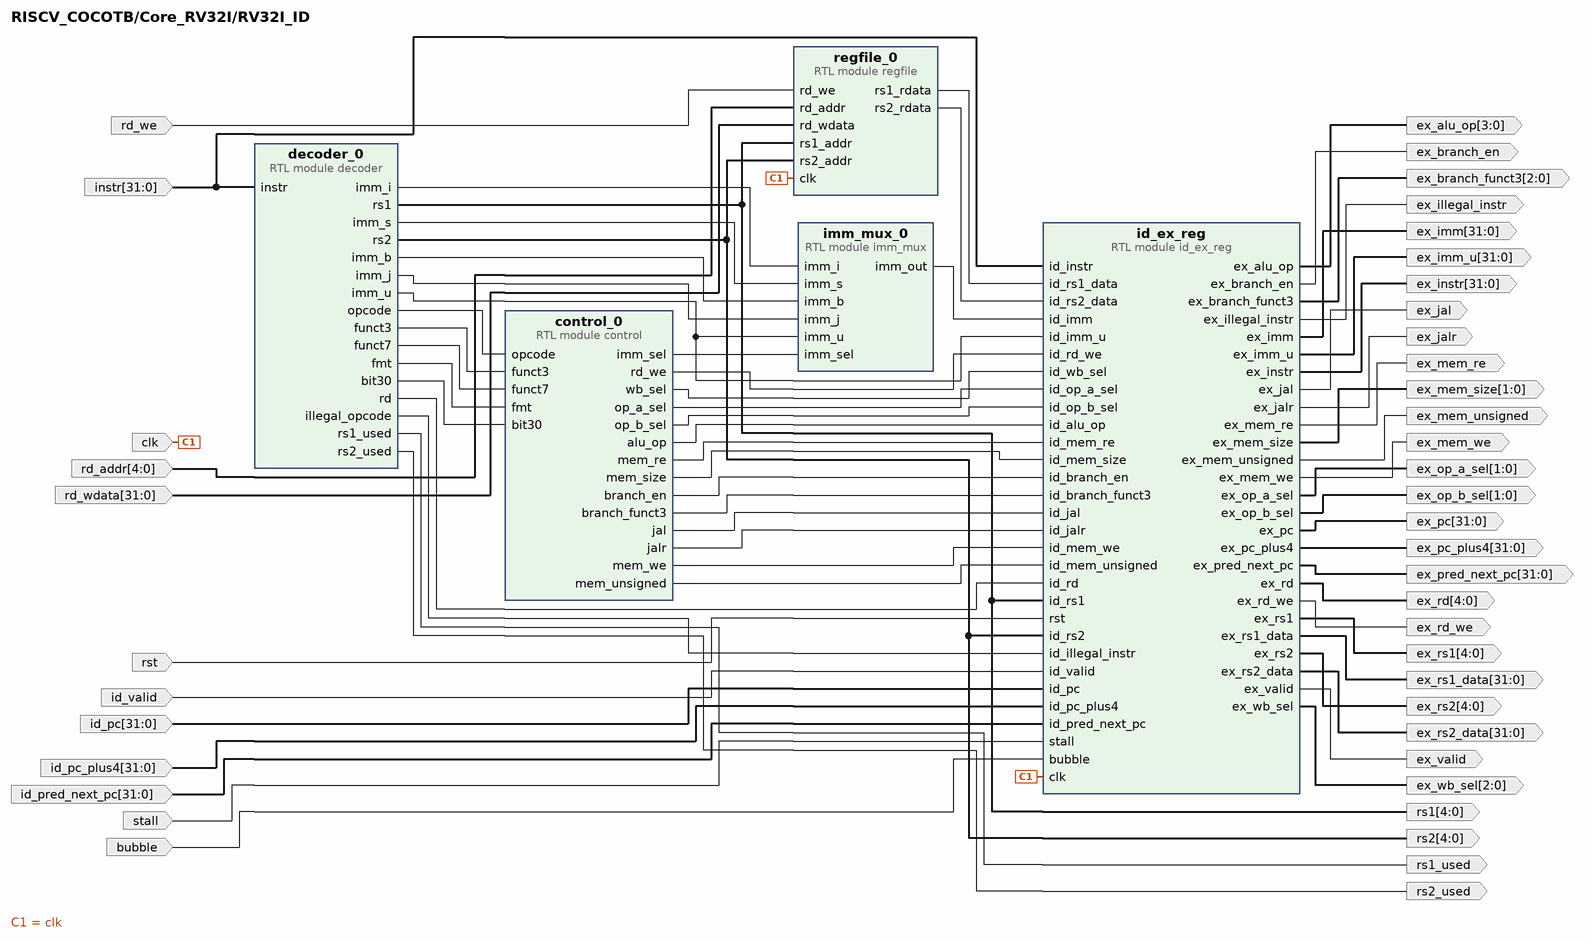
[diagram p7: block diagram inside /Core_RV32I/RV32I_ID]
create_bd_pin -dir I -type clk clk
create_bd_pin -dir I -from 31 -to 0 instr
create_bd_pin -dir I -type rst rst
create_bd_pin -dir I bubble
create_bd_pin -dir I id_valid
create_bd_pin -dir I -from 31 -to 0 id_pc
create_bd_pin -dir I -from 31 -to 0 id_pc_plus4
create_bd_pin -dir O ex_valid
create_bd_pin -dir O -from 31 -to 0 ex_pc
create_bd_pin -dir O -from 31 -to 0 ex_pc_plus4
create_bd_pin -dir O -from 31 -to 0 ex_rs1_data
create_bd_pin -dir O -from 31 -to 0 ex_rs2_data
create_bd_pin -dir O -from 31 -to 0 ex_imm
create_bd_pin -dir O -from 31 -to 0 ex_imm_u
create_bd_pin -dir O -from 4 -to 0 ex_rs1
create_bd_pin -dir O -from 4 -to 0 ex_rs2
create_bd_pin -dir O -from 4 -to 0 ex_rd
create_bd_pin -dir O -from 3 -to 0 ex_alu_op
create_bd_pin -dir O -from 1 -to 0 ex_op_a_sel
create_bd_pin -dir O -from 1 -to 0 ex_op_b_sel
create_bd_pin -dir O ex_branch_en
create_bd_pin -dir O -from 2 -to 0 ex_branch_funct3
create_bd_pin -dir O ex_jal
create_bd_pin -dir O ex_jalr
create_bd_pin -dir O ex_mem_re
create_bd_pin -dir O ex_mem_we
create_bd_pin -dir O -from 1 -to 0 ex_mem_size
create_bd_pin -dir O ex_mem_unsigned
create_bd_pin -dir O ex_rd_we
create_bd_pin -dir O -from 2 -to 0 ex_wb_sel
create_bd_pin -dir O -from 4 -to 0 rs1
create_bd_pin -dir O -from 4 -to 0 rs2
create_bd_pin -dir O rs1_used
create_bd_pin -dir O rs2_used
create_bd_pin -dir I -from 31 -to 0 id_pred_next_pc
create_bd_pin -dir O -from 31 -to 0 ex_pred_next_pc
create_bd_pin -dir I stall
create_bd_pin -dir O -from 31 -to 0 ex_instr
create_bd_pin -dir O ex_illegal_instr
create_bd_pin -dir I rd_we
create_bd_pin -dir I -from 4 -to 0 rd_addr
create_bd_pin -dir I -from 31 -to 0 rd_wdata

create_bd_cell -type module -reference imm_mux imm_mux_0
create_bd_cell -type module -reference control control_0
create_bd_cell -type module -reference id_ex_reg id_ex_reg
create_bd_cell -type module -reference decoder decoder_0
create_bd_cell -type module -reference regfile regfile_0

# ---- hierarchy /Core_RV32I/RV32I_IF ----
current_bd_instance /Core_RV32I/RV32I_IF
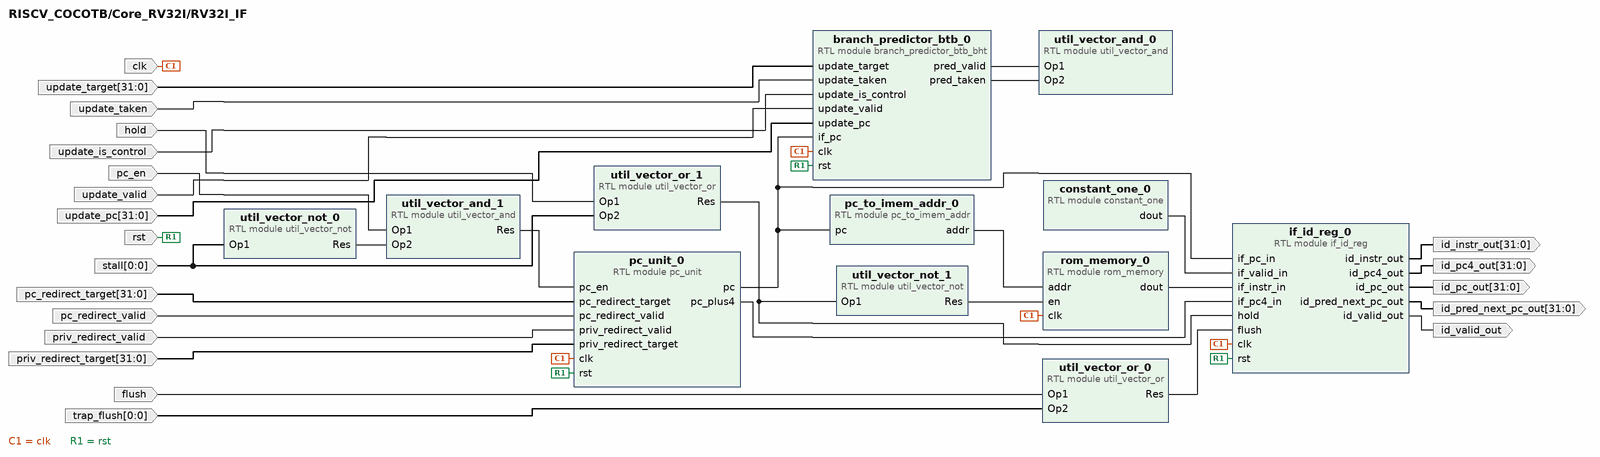
[diagram p8: block diagram inside /Core_RV32I/RV32I_IF]
create_bd_pin -dir I -type clk clk
create_bd_pin -dir I -type rst rst
create_bd_pin -dir I pc_redirect_valid
create_bd_pin -dir I -from 31 -to 0 pc_redirect_target
create_bd_pin -dir I flush
create_bd_pin -dir O -from 31 -to 0 id_pc_out
create_bd_pin -dir O -from 31 -to 0 id_pc4_out
create_bd_pin -dir O -from 31 -to 0 id_instr_out
create_bd_pin -dir O id_valid_out
create_bd_pin -dir I pc_en
create_bd_pin -dir I hold
create_bd_pin -dir I -from 31 -to 0 update_pc
create_bd_pin -dir O -from 31 -to 0 id_pred_next_pc_out
create_bd_pin -dir I -from 31 -to 0 update_target
create_bd_pin -dir I update_taken
create_bd_pin -dir I update_is_control
create_bd_pin -dir I update_valid
create_bd_pin -dir I -from 0 -to 0 stall
create_bd_pin -dir I priv_redirect_valid
create_bd_pin -dir I -from 31 -to 0 priv_redirect_target
create_bd_pin -dir I -from 0 -to 0 trap_flush

create_bd_cell -type module -reference branch_predictor_btb_bht branch_predictor_btb_0
create_bd_cell -type module -reference pc_to_imem_addr pc_to_imem_addr_0
set_property -dict {CONFIG.ADDR_W 11} [get_bd_cells pc_to_imem_addr_0]
create_bd_cell -type module -reference util_vector_and util_vector_and_1
create_bd_cell -type module -reference util_vector_or util_vector_or_1
create_bd_cell -type module -reference util_vector_not util_vector_not_1
create_bd_cell -type module -reference util_vector_and util_vector_and_0
create_bd_cell -type module -reference util_vector_not util_vector_not_0
create_bd_cell -type module -reference util_vector_or util_vector_or_0
create_bd_cell -type module -reference constant_one constant_one_0
create_bd_cell -type module -reference pc_unit pc_unit_0
set_property -dict {CONFIG.RESET_PC 0x80000000} [get_bd_cells pc_unit_0]
create_bd_cell -type module -reference if_id_reg if_id_reg_0
create_bd_cell -type module -reference rom_memory rom_memory_0
set_property -dict [list \
  CONFIG.INIT_FILE /media/steckler/xilinx_linux/RISCV_ZYNQ/V2/RVI20U32/rv32i_vscode/prog.mem \
] [get_bd_cells rom_memory_0]

# ---- hierarchy /MMIO ----
current_bd_instance /MMIO
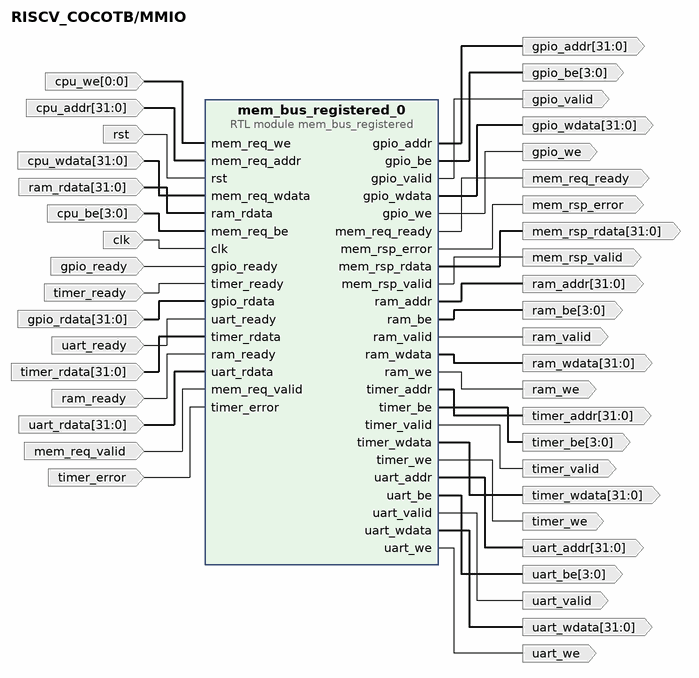
[diagram p9: block diagram inside /MMIO]
create_bd_pin -dir I -type clk clk
create_bd_pin -dir I -type rst rst
create_bd_pin -dir I -from 0 -to 0 cpu_we
create_bd_pin -dir I -from 31 -to 0 cpu_addr
create_bd_pin -dir I -from 31 -to 0 cpu_wdata
create_bd_pin -dir I -from 3 -to 0 cpu_be
create_bd_pin -dir I -from 31 -to 0 ram_rdata
create_bd_pin -dir I -from 31 -to 0 gpio_rdata
create_bd_pin -dir I gpio_ready
create_bd_pin -dir I uart_ready
create_bd_pin -dir I -from 31 -to 0 uart_rdata
create_bd_pin -dir I -from 31 -to 0 timer_rdata
create_bd_pin -dir I timer_ready
create_bd_pin -dir O -from 31 -to 0 mem_rsp_rdata
create_bd_pin -dir O ram_valid
create_bd_pin -dir O ram_we
create_bd_pin -dir O -from 31 -to 0 ram_addr
create_bd_pin -dir O -from 31 -to 0 ram_wdata
create_bd_pin -dir O -from 3 -to 0 ram_be
create_bd_pin -dir O gpio_valid
create_bd_pin -dir O gpio_we
create_bd_pin -dir O -from 31 -to 0 gpio_addr
create_bd_pin -dir O -from 31 -to 0 gpio_wdata
create_bd_pin -dir O -from 3 -to 0 gpio_be
create_bd_pin -dir O uart_valid
create_bd_pin -dir O uart_we
create_bd_pin -dir O -from 31 -to 0 uart_addr
create_bd_pin -dir O -from 31 -to 0 uart_wdata
create_bd_pin -dir O -from 3 -to 0 uart_be
create_bd_pin -dir O timer_valid
create_bd_pin -dir O timer_we
create_bd_pin -dir O -from 31 -to 0 timer_addr
create_bd_pin -dir O -from 31 -to 0 timer_wdata
create_bd_pin -dir O -from 3 -to 0 timer_be
create_bd_pin -dir I ram_ready
create_bd_pin -dir O mem_rsp_valid
create_bd_pin -dir O mem_rsp_error
create_bd_pin -dir I mem_req_valid
create_bd_pin -dir O mem_req_ready
create_bd_pin -dir I timer_error

create_bd_cell -type module -reference mem_bus_registered mem_bus_registered_0

# ---- hierarchy /PRIVILEGED ----
current_bd_instance /PRIVILEGED
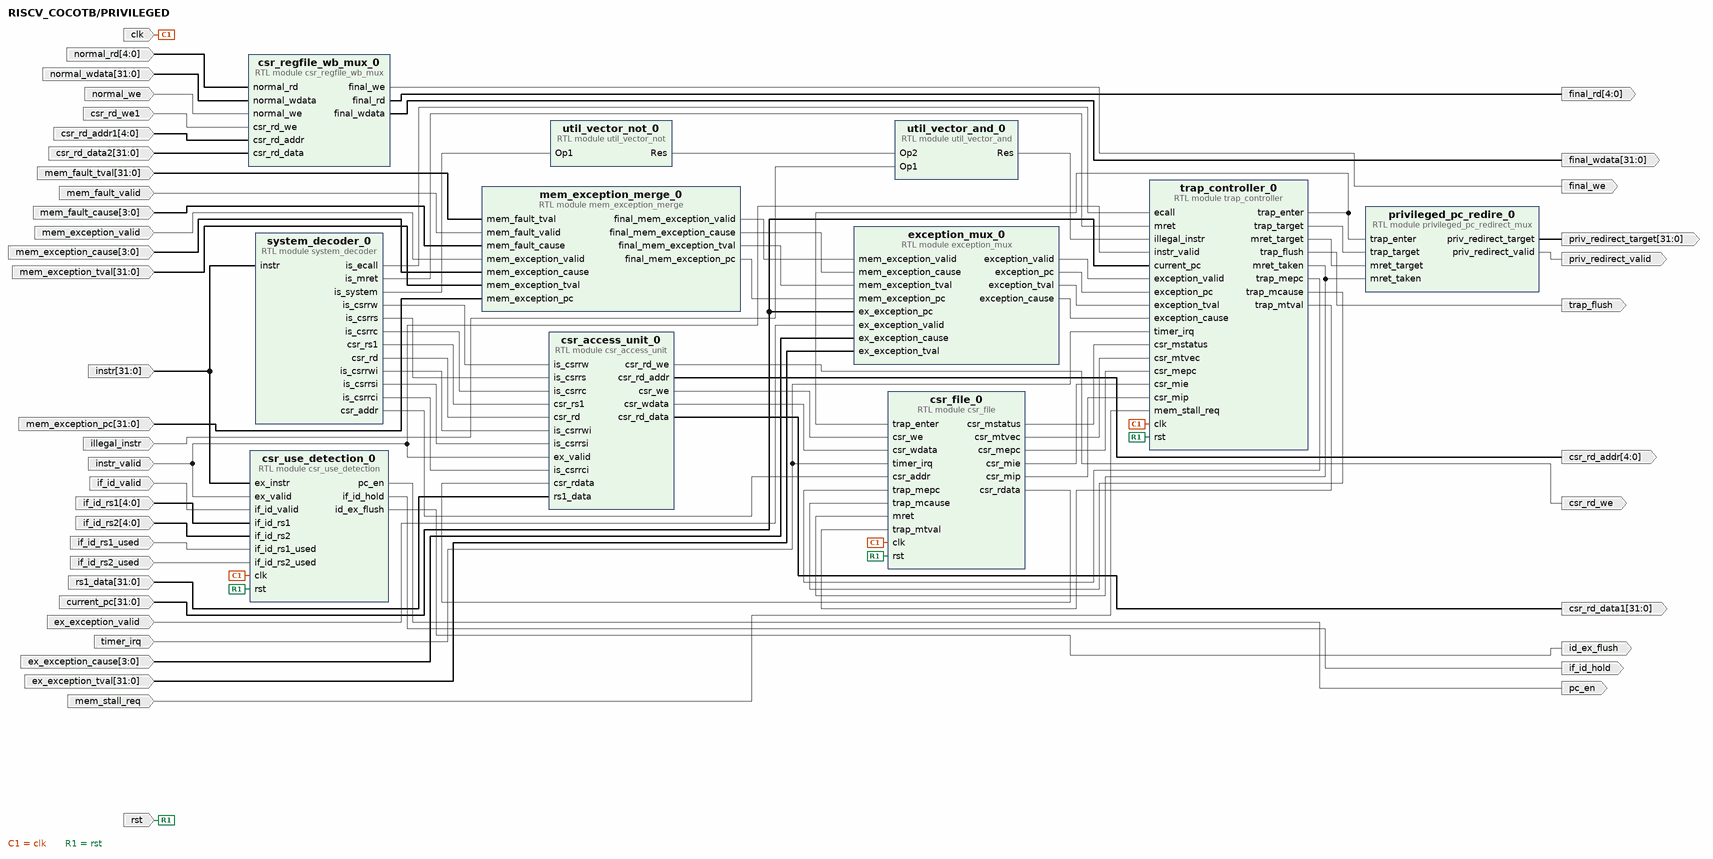
[diagram p10: block diagram inside /PRIVILEGED]
create_bd_pin -dir I -from 31 -to 0 instr
create_bd_pin -dir I instr_valid
create_bd_pin -dir I -type clk clk
create_bd_pin -dir I -type rst rst
create_bd_pin -dir I -from 31 -to 0 current_pc
create_bd_pin -dir I illegal_instr
create_bd_pin -dir I -type intr timer_irq
create_bd_pin -dir I mem_stall_req
create_bd_pin -dir O trap_flush
create_bd_pin -dir I -from 4 -to 0 normal_rd
create_bd_pin -dir I -from 31 -to 0 normal_wdata
create_bd_pin -dir O final_we
create_bd_pin -dir O -from 4 -to 0 final_rd
create_bd_pin -dir O -from 31 -to 0 final_wdata
create_bd_pin -dir O priv_redirect_valid
create_bd_pin -dir O -from 31 -to 0 priv_redirect_target
create_bd_pin -dir I -from 31 -to 0 rs1_data
create_bd_pin -dir I normal_we
create_bd_pin -dir O csr_rd_we
create_bd_pin -dir O -from 4 -to 0 csr_rd_addr
create_bd_pin -dir O -from 31 -to 0 csr_rd_data1
create_bd_pin -dir I csr_rd_we1
create_bd_pin -dir I -from 4 -to 0 csr_rd_addr1
create_bd_pin -dir I -from 31 -to 0 csr_rd_data2
create_bd_pin -dir I ex_exception_valid
create_bd_pin -dir I -from 3 -to 0 ex_exception_cause
create_bd_pin -dir I -from 31 -to 0 ex_exception_tval
create_bd_pin -dir I -from 31 -to 0 mem_fault_tval
create_bd_pin -dir I mem_fault_valid
create_bd_pin -dir I -from 3 -to 0 mem_fault_cause
create_bd_pin -dir I mem_exception_valid
create_bd_pin -dir I -from 3 -to 0 mem_exception_cause
create_bd_pin -dir I -from 31 -to 0 mem_exception_tval
create_bd_pin -dir I -from 31 -to 0 mem_exception_pc
create_bd_pin -dir I if_id_valid
create_bd_pin -dir I -from 4 -to 0 if_id_rs1
create_bd_pin -dir I -from 4 -to 0 if_id_rs2
create_bd_pin -dir I if_id_rs1_used
create_bd_pin -dir I if_id_rs2_used
create_bd_pin -dir O pc_en
create_bd_pin -dir O if_id_hold
create_bd_pin -dir O id_ex_flush

create_bd_cell -type module -reference privileged_pc_redirect_mux privileged_pc_redire_0
create_bd_cell -type module -reference exception_mux exception_mux_0
create_bd_cell -type module -reference mem_exception_merge mem_exception_merge_0
create_bd_cell -type module -reference util_vector_and util_vector_and_0
create_bd_cell -type module -reference util_vector_not util_vector_not_0
create_bd_cell -type module -reference csr_access_unit csr_access_unit_0
create_bd_cell -type module -reference trap_controller trap_controller_0
create_bd_cell -type module -reference system_decoder system_decoder_0
create_bd_cell -type module -reference csr_file csr_file_0
create_bd_cell -type module -reference csr_regfile_wb_mux csr_regfile_wb_mux_0
create_bd_cell -type module -reference csr_use_detection csr_use_detection_0

# ---- hierarchy /GPIO ----
current_bd_instance /GPIO
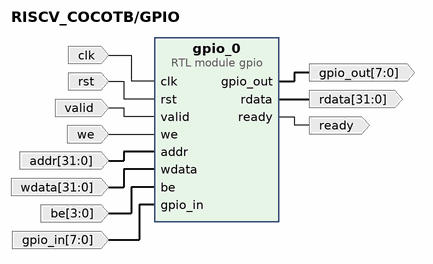
[diagram p11: block diagram inside /GPIO]
create_bd_pin -dir I -type clk clk
create_bd_pin -dir I -type rst rst
create_bd_pin -dir I valid
create_bd_pin -dir I we
create_bd_pin -dir I -from 31 -to 0 addr
create_bd_pin -dir I -from 31 -to 0 wdata
create_bd_pin -dir I -from 3 -to 0 be
create_bd_pin -dir O -from 31 -to 0 rdata
create_bd_pin -dir O ready
create_bd_pin -dir O -from 7 -to 0 gpio_out
create_bd_pin -dir I -from 7 -to 0 gpio_in

create_bd_cell -type module -reference gpio gpio_0

# ---- hierarchy /RV32I_RAM_MEMORY ----
current_bd_instance /RV32I_RAM_MEMORY
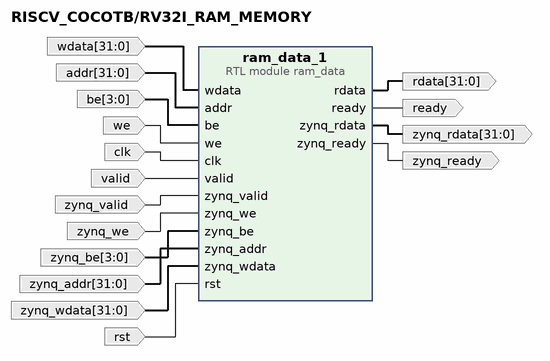
[diagram p12: block diagram inside /RV32I_RAM_MEMORY]
create_bd_pin -dir O -from 31 -to 0 rdata
create_bd_pin -dir I -from 31 -to 0 wdata
create_bd_pin -dir I -from 31 -to 0 addr
create_bd_pin -dir I -from 3 -to 0 be
create_bd_pin -dir I we
create_bd_pin -dir I -type clk clk
create_bd_pin -dir I -type rst rst
create_bd_pin -dir O ready
create_bd_pin -dir I valid
create_bd_pin -dir I zynq_valid
create_bd_pin -dir I zynq_we
create_bd_pin -dir I -from 3 -to 0 zynq_be
create_bd_pin -dir I -from 31 -to 0 zynq_addr
create_bd_pin -dir I -from 31 -to 0 zynq_wdata
create_bd_pin -dir O -from 31 -to 0 zynq_rdata
create_bd_pin -dir O zynq_ready

create_bd_cell -type module -reference ram_data ram_data_1

# ---- connections ----

current_bd_instance /UART
connect_bd_net -net zynq_ultra_ps_e_0_pl_clk0 [get_bd_pins clk] [get_bd_pins uart_0/clk]
connect_bd_net -net MMIO_uart_valid [get_bd_pins valid] [get_bd_pins uart_0/valid]
connect_bd_net -net MMIO_uart_we [get_bd_pins we] [get_bd_pins uart_0/we]
connect_bd_net -net MMIO_uart_addr [get_bd_pins addr] [get_bd_pins uart_0/addr]
connect_bd_net -net MMIO_uart_wdata [get_bd_pins wdata] [get_bd_pins uart_0/wdata]
connect_bd_net -net MMIO_uart_be [get_bd_pins be] [get_bd_pins uart_0/be]
connect_bd_net [get_bd_pins rx] [get_bd_pins uart_0/rx]
connect_bd_net [get_bd_pins uart_0/rdata] [get_bd_pins rdata]
connect_bd_net [get_bd_pins uart_0/ready] [get_bd_pins ready]
connect_bd_net [get_bd_pins uart_0/tx] [get_bd_pins tx]
connect_bd_net [get_bd_pins rst] [get_bd_pins uart_0/rst]

current_bd_instance /TIMER
connect_bd_net -net zynq_ultra_ps_e_0_pl_clk0 [get_bd_pins clk] [get_bd_pins timer_0/clk]
connect_bd_net -net proc_sys_reset_0_peripheral_reset [get_bd_pins rst] [get_bd_pins timer_0/rst]
connect_bd_net -net MMIO_timer_valid [get_bd_pins valid] [get_bd_pins timer_0/valid]
connect_bd_net -net MMIO_timer_we [get_bd_pins we] [get_bd_pins timer_0/we]
connect_bd_net -net MMIO_timer_be [get_bd_pins be] [get_bd_pins timer_0/be]
connect_bd_net -net MMIO_timer_addr [get_bd_pins addr] [get_bd_pins timer_0/addr]
connect_bd_net -net MMIO_timer_wdata [get_bd_pins wdata] [get_bd_pins timer_0/wdata]
connect_bd_net [get_bd_pins timer_0/rdata] [get_bd_pins rdata]
connect_bd_net [get_bd_pins timer_0/ready] [get_bd_pins ready]
connect_bd_net [get_bd_pins timer_0/timer_irq] [get_bd_pins timer_irq]
connect_bd_net [get_bd_pins timer_0/error] [get_bd_pins error]

current_bd_instance /Core_RV32I
connect_bd_net -net mem_wb_reg_0_wb_rd [get_bd_pins RV32I_MEM/wb_rd] [get_bd_pins wb_rd]
connect_bd_net -net wb_mux_0_rd_wdata [get_bd_pins RV32I_WB/rd_wdata] [get_bd_pins rd_wdata1]
connect_bd_net -net ex_mem_reg_1_mem_valid [get_bd_pins RV32I_EX/mem_valid] [get_bd_pins RV32I_MEM/mem_in_valid]
connect_bd_net -net ex_mem_reg_1_mem_alu_result [get_bd_pins RV32I_EX/ex_mem_data] [get_bd_pins RV32I_MEM/mem_in_alu_result]
connect_bd_net -net ex_mem_reg_1_mem_store_data [get_bd_pins RV32I_EX/mem_store_data] [get_bd_pins RV32I_MEM/mem_in_store_data]
connect_bd_net -net ex_mem_reg_1_mem_pc_plus4 [get_bd_pins RV32I_EX/mem_pc_plus4] [get_bd_pins RV32I_MEM/mem_in_pc_plus4]
connect_bd_net -net ex_mem_reg_1_mem_imm_u [get_bd_pins RV32I_EX/mem_imm_u] [get_bd_pins RV32I_MEM/mem_in_imm_u]
connect_bd_net -net ex_mem_reg_1_mem_rd [get_bd_pins RV32I_EX/mem_rd] [get_bd_pins RV32I_MEM/mem_in_rd]
connect_bd_net -net ex_mem_reg_1_mem_mem_re [get_bd_pins RV32I_EX/mem_mem_re] [get_bd_pins RV32I_MEM/mem_in_mem_re]
connect_bd_net -net ex_mem_reg_1_mem_mem_size [get_bd_pins RV32I_EX/mem_mem_size] [get_bd_pins RV32I_MEM/mem_in_mem_size]
connect_bd_net -net ex_mem_reg_1_mem_mem_unsigned [get_bd_pins RV32I_EX/mem_mem_unsigned] [get_bd_pins RV32I_MEM/mem_in_mem_unsigned]
connect_bd_net -net ex_mem_reg_1_mem_rd_we [get_bd_pins RV32I_EX/mem_rd_we] [get_bd_pins RV32I_MEM/mem_in_rd_we]
connect_bd_net -net ex_mem_reg_1_mem_wb_sel [get_bd_pins RV32I_EX/mem_wb_sel] [get_bd_pins RV32I_MEM/mem_in_wb_sel]
connect_bd_net -net mem_stage_0_mem_out_valid [get_bd_pins RV32I_MEM/mem_stage_out_valid] [get_bd_pins RV32I_EX/mem_stage_out_valid]
connect_bd_net -net mem_stage_0_mem_out_rd [get_bd_pins RV32I_MEM/mem_rd] [get_bd_pins RV32I_EX/mem_stage_rd]
connect_bd_net -net mem_stage_0_mem_forward_data [get_bd_pins RV32I_MEM/mem_forward_data] [get_bd_pins RV32I_EX/mem_stage_data]
connect_bd_net -net zynq_ultra_ps_e_0_pl_clk0 [get_bd_pins clk] \
  [get_bd_pins RV32I_EX/clk] [get_bd_pins RV32I_MEM/clk] [get_bd_pins RV32I_ID/clk] [get_bd_pins RV32I_IF/clk]
connect_bd_net -net proc_sys_reset_0_peripheral_reset [get_bd_pins rst] \
  [get_bd_pins RV32I_EX/rst] [get_bd_pins RV32I_MEM/rst] [get_bd_pins RV32I_ID/rst] [get_bd_pins RV32I_IF/rst]
connect_bd_net -net mmio_0_cpu_rdata [get_bd_pins mem_data] [get_bd_pins RV32I_MEM/mem_data]
connect_bd_net [get_bd_pins RV32I_MEM/dmem_be] [get_bd_pins dmem_be]
connect_bd_net [get_bd_pins RV32I_MEM/dmem_addr] [get_bd_pins dmem_addr]
connect_bd_net [get_bd_pins RV32I_MEM/dmem_wdata] [get_bd_pins dmem_wdata]
connect_bd_net [get_bd_pins RV32I_MEM/dmem_we] [get_bd_pins dmem_we]
connect_bd_net -net ex_mem_reg_1_mem_mem_we [get_bd_pins RV32I_EX/mem_mem_we] [get_bd_pins RV32I_MEM/mem_in_mem_we]
connect_bd_net [get_bd_pins RV32I_IF/id_valid_out] \
  [get_bd_pins RV32I_ID/id_valid] [get_bd_pins load_use_detection_0/if_id_valid] [get_bd_pins id_valid_out]
connect_bd_net [get_bd_pins RV32I_ID/ex_rd] [get_bd_pins RV32I_EX/ex_rd] [get_bd_pins load_use_detection_0/id_ex_rd]
connect_bd_net -net ex_mem_we_1 [get_bd_pins RV32I_ID/ex_mem_we] [get_bd_pins RV32I_EX/ex_mem_we]
connect_bd_net -net ex_mem_re_1 [get_bd_pins RV32I_ID/ex_mem_re] [get_bd_pins RV32I_EX/ex_mem_re] [get_bd_pins load_use_detection_0/id_ex_mem_re]
connect_bd_net -net pc_1 [get_bd_pins RV32I_ID/ex_pc] [get_bd_pins RV32I_EX/pc] [get_bd_pins ex_pc] [get_bd_pins RV32I_IF/update_pc]
connect_bd_net -net ex_mem_size_1 [get_bd_pins RV32I_ID/ex_mem_size] [get_bd_pins RV32I_EX/ex_mem_size]
connect_bd_net -net ex_mem_unsigned_1 [get_bd_pins RV32I_ID/ex_mem_unsigned] [get_bd_pins RV32I_EX/ex_mem_unsigned]
connect_bd_net -net ex_rd_we_1 [get_bd_pins RV32I_ID/ex_rd_we] [get_bd_pins RV32I_EX/ex_rd_we] [get_bd_pins load_use_detection_0/id_ex_rd_we]
connect_bd_net -net ex_wb_sel_1 [get_bd_pins RV32I_ID/ex_wb_sel] [get_bd_pins RV32I_EX/ex_wb_sel]
connect_bd_net -net ex_imm_1 [get_bd_pins RV32I_ID/ex_imm] [get_bd_pins RV32I_EX/ex_imm]
connect_bd_net -net ex_op_b_sel_1 [get_bd_pins RV32I_ID/ex_op_b_sel] [get_bd_pins RV32I_EX/ex_op_b_sel]
connect_bd_net -net op_a_sel_1 [get_bd_pins RV32I_ID/ex_op_a_sel] [get_bd_pins RV32I_EX/op_a_sel]
connect_bd_net -net ex_rs1_data_1 [get_bd_pins RV32I_ID/ex_rs1_data] [get_bd_pins RV32I_EX/ex_rs1_data]
connect_bd_net -net ex_rs2_data_1 [get_bd_pins RV32I_ID/ex_rs2_data] [get_bd_pins RV32I_EX/ex_rs2_data]
connect_bd_net -net ex_rs1_1 [get_bd_pins RV32I_ID/ex_rs1] [get_bd_pins RV32I_EX/ex_rs1]
connect_bd_net -net ex_rs2_1 [get_bd_pins RV32I_ID/ex_rs2] [get_bd_pins RV32I_EX/ex_rs2]
connect_bd_net -net ex_branch_en_1 [get_bd_pins RV32I_ID/ex_branch_en] [get_bd_pins RV32I_EX/ex_branch_en]
connect_bd_net -net ex_branch_funct3_1 [get_bd_pins RV32I_ID/ex_branch_funct3] [get_bd_pins RV32I_EX/ex_branch_funct3]
connect_bd_net -net ex_jal_1 [get_bd_pins RV32I_ID/ex_jal] [get_bd_pins RV32I_EX/ex_jal]
connect_bd_net -net ex_jalr_1 [get_bd_pins RV32I_ID/ex_jalr] [get_bd_pins RV32I_EX/ex_jalr]
connect_bd_net -net ex_imm_u_1 [get_bd_pins RV32I_ID/ex_imm_u] [get_bd_pins RV32I_EX/ex_imm_u]
connect_bd_net -net ex_valid_1 [get_bd_pins RV32I_ID/ex_valid] \
  [get_bd_pins RV32I_EX/ex_valid] [get_bd_pins ex_valid] [get_bd_pins load_use_detection_0/id_ex_valid]
connect_bd_net -net alu_op_1 [get_bd_pins RV32I_ID/ex_alu_op] [get_bd_pins RV32I_EX/alu_op]
connect_bd_net [get_bd_pins RV32I_ID/rs1] [get_bd_pins load_use_detection_0/if_id_rs1] [get_bd_pins rs1]
connect_bd_net [get_bd_pins RV32I_ID/rs2] [get_bd_pins load_use_detection_0/if_id_rs2] [get_bd_pins rs2]
connect_bd_net [get_bd_pins RV32I_ID/rs1_used] [get_bd_pins load_use_detection_0/if_id_rs1_used] [get_bd_pins rs1_used]
connect_bd_net [get_bd_pins RV32I_ID/rs2_used] [get_bd_pins load_use_detection_0/if_id_rs2_used] [get_bd_pins rs2_used]
connect_bd_net [get_bd_pins RV32I_ID/ex_pred_next_pc] [get_bd_pins RV32I_EX/ex_pred_next_pc]
connect_bd_net [get_bd_pins dmem_ready] [get_bd_pins RV32I_MEM/dmem_ready]
connect_bd_net -net Op3_1 [get_bd_pins RV32I_MEM/mem_stall_req] \
  [get_bd_pins RV32I_ID/stall] [get_bd_pins RV32I_EX/stall] [get_bd_pins mem_stall_req] [get_bd_pins RV32I_IF/stall] \
  [get_bd_pins priority_branch_OR_l_0/mem_stall_req]
connect_bd_net [get_bd_pins RV32I_ID/ex_instr] [get_bd_pins ex_instr]
connect_bd_net [get_bd_pins RV32I_ID/ex_illegal_instr] [get_bd_pins ex_illegal_instr]
connect_bd_net [get_bd_pins priv_redirect_valid] [get_bd_pins RV32I_IF/priv_redirect_valid] [get_bd_pins priority_branch_OR_l_0/priv_redirect_valid]
connect_bd_net -net rd_we1_1 [get_bd_pins rd_we] [get_bd_pins RV32I_ID/rd_we] [get_bd_pins RV32I_EX/wb_rd_we] [get_bd_pins RV32I_EX/wb_valid]
connect_bd_net -net rd_addr1_1 [get_bd_pins rd_addr] [get_bd_pins RV32I_ID/rd_addr] [get_bd_pins RV32I_EX/wb_rd]
connect_bd_net -net rd_wdata1_1 [get_bd_pins rd_wdata] [get_bd_pins RV32I_ID/rd_wdata] [get_bd_pins RV32I_EX/mem_wb_data]
connect_bd_net [get_bd_pins RV32I_MEM/wb_sel] [get_bd_pins RV32I_WB/wb_sel]
connect_bd_net [get_bd_pins RV32I_MEM/wb_data] [get_bd_pins RV32I_WB/load_data]
connect_bd_net [get_bd_pins RV32I_MEM/wb_alu_result] [get_bd_pins RV32I_WB/alu_y]
connect_bd_net [get_bd_pins RV32I_MEM/wb_pc_plus4] [get_bd_pins RV32I_WB/pc_plus4]
connect_bd_net [get_bd_pins RV32I_MEM/wb_imm_u] [get_bd_pins RV32I_WB/imm_u]
connect_bd_net [get_bd_pins RV32I_EX/out_data] [get_bd_pins out_data]
connect_bd_net -net ex_pc_plus4_1 [get_bd_pins RV32I_ID/ex_pc_plus4] [get_bd_pins RV32I_EX/ex_pc_plus4]
connect_bd_net -net Op4_1 [get_bd_pins trap_flush] [get_bd_pins RV32I_IF/trap_flush]
connect_bd_net [get_bd_pins priv_redirect_target] [get_bd_pins RV32I_IF/priv_redirect_target]
connect_bd_net [get_bd_pins RV32I_EX/bp_update_valid] [get_bd_pins RV32I_IF/update_valid]
connect_bd_net -net update_is_control_1 [get_bd_pins RV32I_EX/bp_update_is_control] [get_bd_pins RV32I_IF/update_is_control]
connect_bd_net [get_bd_pins RV32I_EX/bp_update_taken] [get_bd_pins RV32I_IF/update_taken]
connect_bd_net [get_bd_pins RV32I_EX/bp_update_target] [get_bd_pins RV32I_IF/update_target]
connect_bd_net [get_bd_pins RV32I_IF/id_pred_next_pc_out] [get_bd_pins RV32I_ID/id_pred_next_pc]
connect_bd_net [get_bd_pins RV32I_IF/id_instr_out] [get_bd_pins RV32I_ID/instr]
connect_bd_net [get_bd_pins RV32I_IF/id_pc4_out] [get_bd_pins RV32I_ID/id_pc_plus4]
connect_bd_net [get_bd_pins RV32I_IF/id_pc_out] [get_bd_pins RV32I_ID/id_pc]
connect_bd_net [get_bd_pins RV32I_EX/pc_redirect_target] [get_bd_pins RV32I_IF/pc_redirect_target]
connect_bd_net [get_bd_pins RV32I_EX/pc_redirect_valid] [get_bd_pins RV32I_IF/pc_redirect_valid]
connect_bd_net -net RV32I_MEM_mem_rd_we [get_bd_pins RV32I_MEM/mem_stage_rd_out_we] [get_bd_pins RV32I_EX/mem_stage_rd_out_we]
connect_bd_net [get_bd_pins dmem_error] [get_bd_pins RV32I_MEM/dmem_error]
connect_bd_net [get_bd_pins RV32I_MEM/regfile_we] [get_bd_pins regfile_we]
connect_bd_net [get_bd_pins RV32I_MEM/dmem_valid] [get_bd_pins dmem_valid]
connect_bd_net [get_bd_pins dmem_req_ready] [get_bd_pins RV32I_MEM/dmem_req_ready]
connect_bd_net [get_bd_pins ex_csr_rd_we] [get_bd_pins RV32I_EX/ex_csr_rd_we]
connect_bd_net [get_bd_pins ex_csr_rd_addr] [get_bd_pins RV32I_EX/ex_csr_rd_addr]
connect_bd_net [get_bd_pins ex_csr_rd_data] [get_bd_pins RV32I_EX/ex_csr_rd_data]
connect_bd_net [get_bd_pins RV32I_EX/mem_csr_rd_we] [get_bd_pins RV32I_MEM/mem_csr_rd_we]
connect_bd_net -net mem_csr_rd_addr_1 [get_bd_pins RV32I_EX/mem_csr_rd_addr] [get_bd_pins RV32I_MEM/mem_csr_rd_addr]
connect_bd_net [get_bd_pins RV32I_EX/mem_csr_rd_data] [get_bd_pins RV32I_MEM/mem_csr_rd_data]
connect_bd_net [get_bd_pins RV32I_MEM/wb_csr_rd_we] [get_bd_pins wb_csr_rd_we]
connect_bd_net [get_bd_pins RV32I_MEM/wb_csr_rd_addr] [get_bd_pins wb_csr_rd_addr]
connect_bd_net [get_bd_pins RV32I_MEM/wb_csr_rd_data] [get_bd_pins wb_csr_rd_data]
connect_bd_net [get_bd_pins RV32I_EX/mem_exception_valid] [get_bd_pins mem_exception_valid]
connect_bd_net [get_bd_pins RV32I_EX/ex_exception_valid] [get_bd_pins ex_exception_valid]
connect_bd_net [get_bd_pins RV32I_EX/ex_exception_cause] [get_bd_pins ex_exception_cause]
connect_bd_net [get_bd_pins RV32I_EX/ex_exception_tval] [get_bd_pins ex_exception_tval]
connect_bd_net [get_bd_pins RV32I_EX/mem_pc] [get_bd_pins mem_pc]
connect_bd_net [get_bd_pins RV32I_EX/mem_exception_cause] [get_bd_pins mem_exception_cause]
connect_bd_net [get_bd_pins RV32I_EX/mem_exception_tval] [get_bd_pins mem_exception_tval]
connect_bd_net [get_bd_pins RV32I_MEM/mem_fault_valid] [get_bd_pins mem_fault_valid]
connect_bd_net [get_bd_pins RV32I_MEM/mem_fault_cause] [get_bd_pins mem_fault_cause]
connect_bd_net [get_bd_pins RV32I_MEM/mem_fault_tval] [get_bd_pins mem_fault_tval]
connect_bd_net [get_bd_pins load_use_detection_0/pc_en] [get_bd_pins priority_branch_OR_l_0/load_use_pc_en]
connect_bd_net [get_bd_pins load_use_detection_0/if_id_hold] [get_bd_pins priority_branch_OR_l_0/load_use_if_id_hold]
connect_bd_net [get_bd_pins load_use_detection_0/id_ex_flush] [get_bd_pins priority_branch_OR_l_0/load_use_id_ex_flush]
connect_bd_net [get_bd_pins csr_use_pc_en] [get_bd_pins priority_branch_OR_l_0/csr_use_pc_en]
connect_bd_net [get_bd_pins csr_use_if_id_hold] [get_bd_pins priority_branch_OR_l_0/csr_use_if_id_hold]
connect_bd_net [get_bd_pins csr_use_id_ex_flush] [get_bd_pins priority_branch_OR_l_0/csr_use_id_ex_flush]
connect_bd_net -net bubble_1 [get_bd_pins priority_branch_OR_l_0/id_ex_flush_final] [get_bd_pins RV32I_ID/bubble]
connect_bd_net -net flush_1 [get_bd_pins priority_branch_OR_l_0/if_id_flush_final] [get_bd_pins RV32I_IF/flush]
connect_bd_net -net pc_en_1 [get_bd_pins priority_branch_OR_l_0/pc_en_final] [get_bd_pins RV32I_IF/pc_en]
connect_bd_net -net hold_1 [get_bd_pins priority_branch_OR_l_0/if_id_hold_final] [get_bd_pins RV32I_IF/hold]
connect_bd_net [get_bd_pins RV32I_EX/ex_flush_req] [get_bd_pins priority_branch_OR_l_0/ex_flush_req]
